# EAGLE design Mobo-v09 (EAGLE 9.7.0)

## Sheet 1 of 5
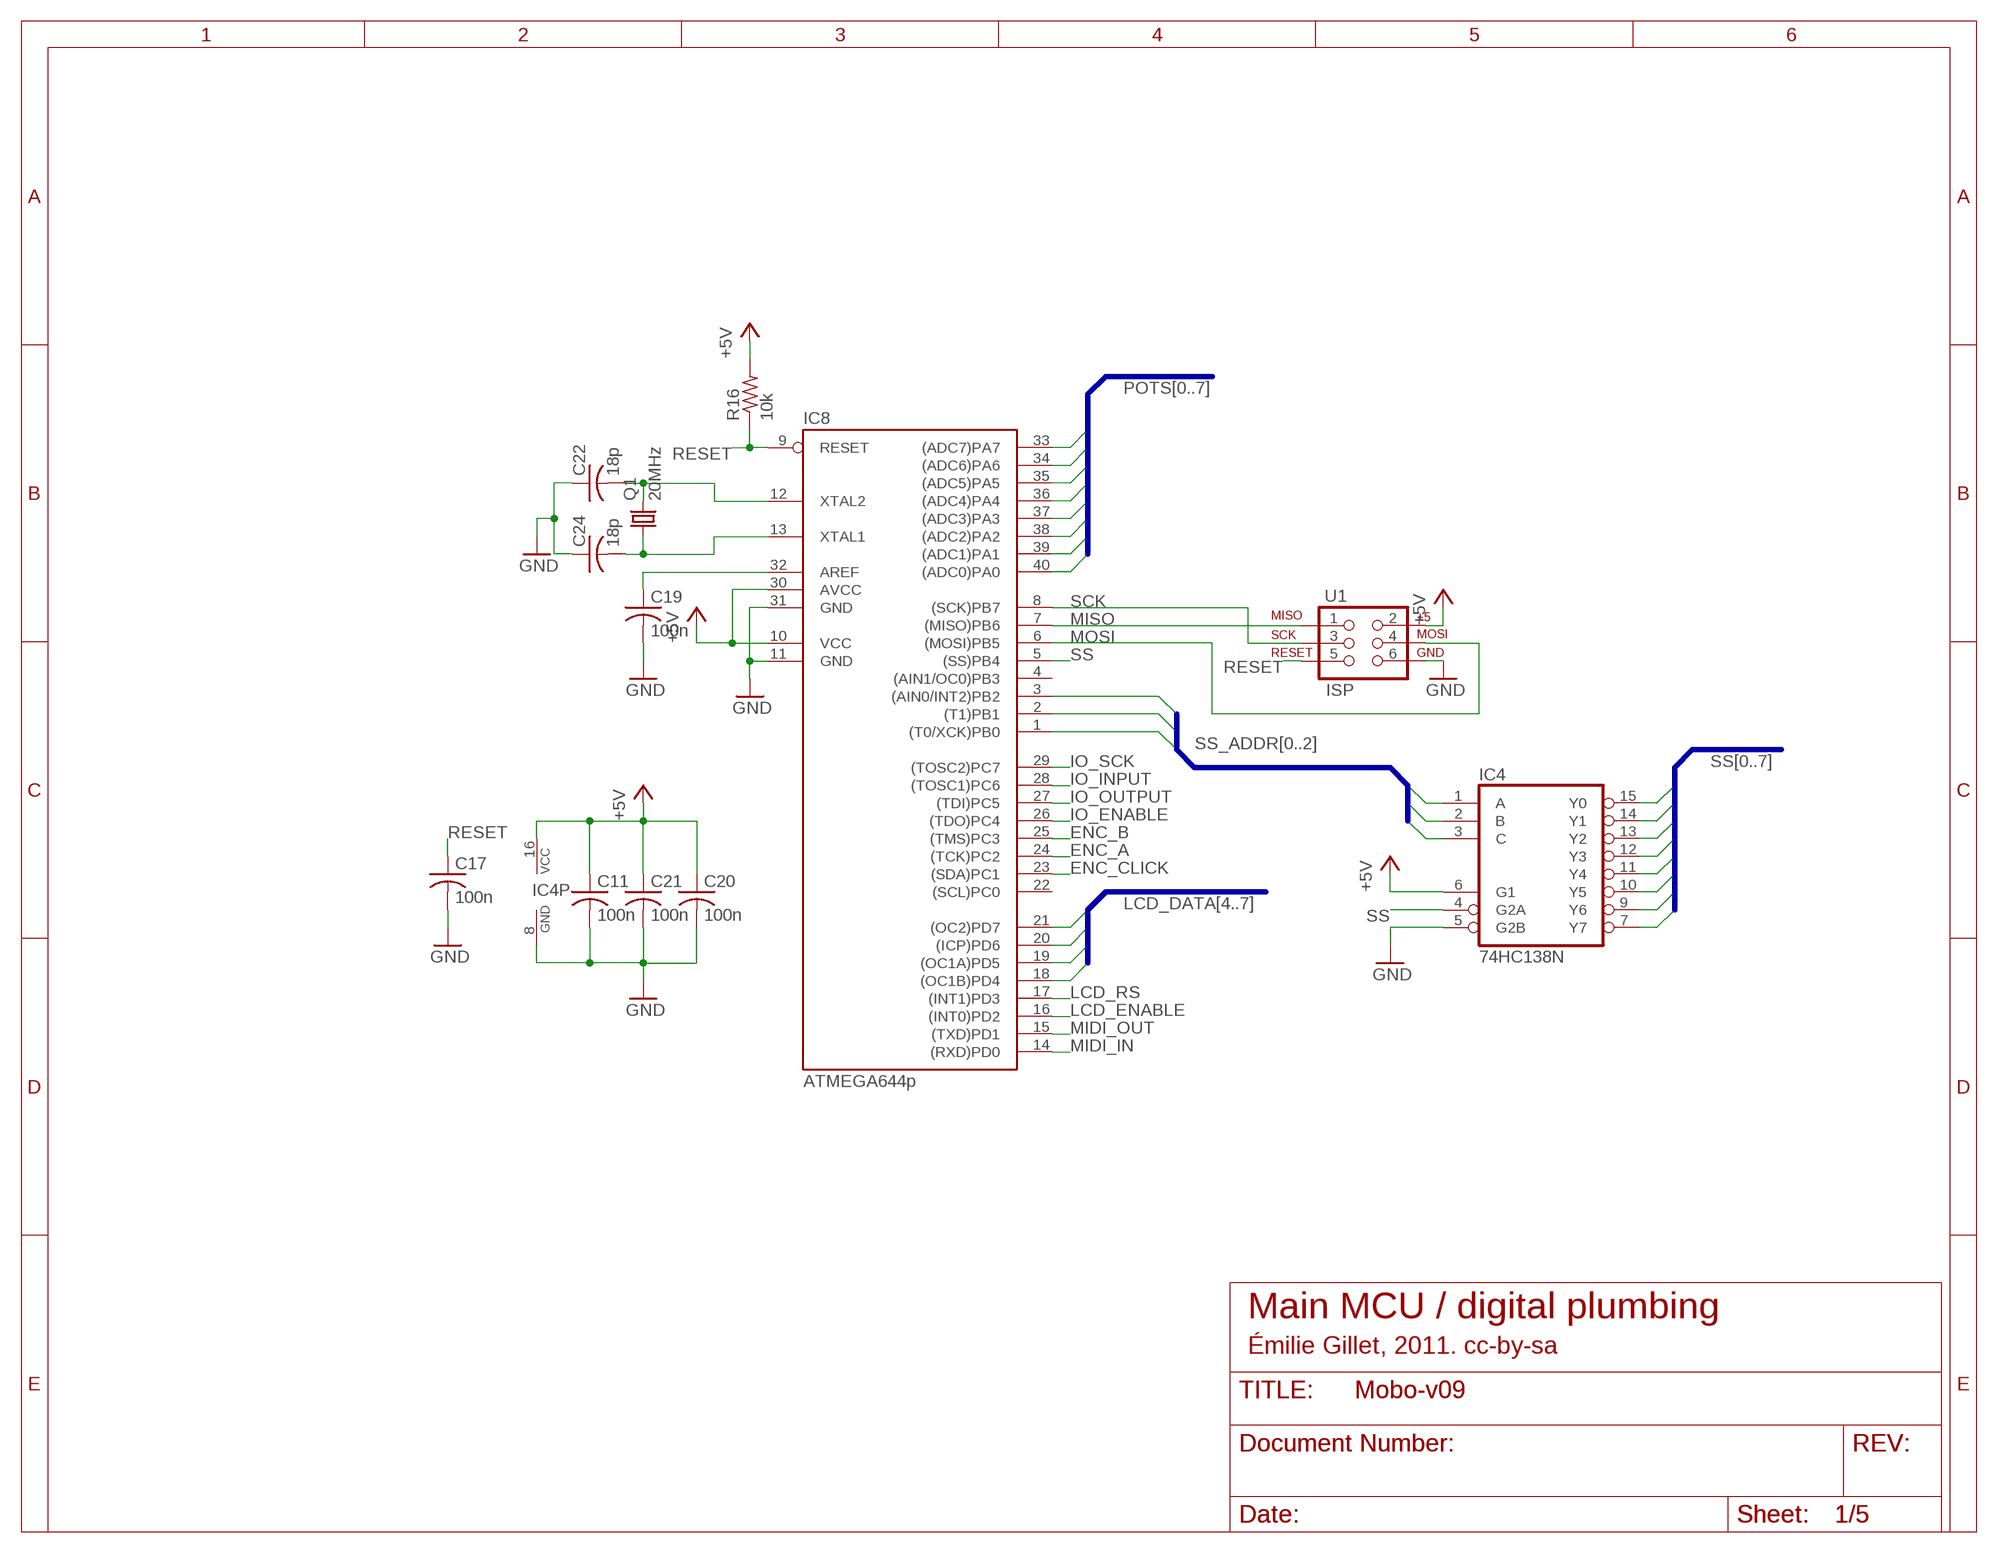
[diagram p0: schematic, sheet 1]

### Parts
C11  100n  C-US025-024X044  [C025-024X044]
C17  100n  C-US025-024X044  [C025-024X044]
C19  100n  C-US025-024X044  [C025-024X044]
C20  100n  C-US025-024X044  [C025-024X044]
C21  100n  C-US025-024X044  [C025-024X044]
C22  18p  C-US025-024X044  [C025-024X044]
C24  18p  C-US025-024X044  [C025-024X044]
IC4  74HC138N  [DIL16]
IC8  ATMEGA644p  MEGA16-P  [DIL40]
Q1  20MHz  CRYSTALHC49U-V  [HC49U-V]
R16  10k  R-US_0204/7  [0204/7]
U1  ISP  AVR_SPI_PRG_6PTH  [2X3]

### Nets
+5V: C11.1 C20.1 C21.1 IC4.6(G1) IC4.16(VCC) IC8.10(VCC) IC8.30(AVCC) R16.2 U1.2 ; also sheet 2,3,4,5
ENC_A: IC8.24((TCK)PC2) ; also sheet 2
ENC_B: IC8.25((TMS)PC3) ; also sheet 2
ENC_CLICK: IC8.23((SDA)PC1) ; also sheet 2
GND: C11.2 C17.2 C19.2 C20.2 C21.2 C22.1 C24.1 IC4.5(G2B) IC4.8(GND) IC8.11(GND) IC8.31(GND) U1.6 ; also sheet 2,3,4,5
IO_ENABLE: IC8.26((TDO)PC4) ; also sheet 2
IO_INPUT: IC8.28((TOSC1)PC6) ; also sheet 2
IO_OUTPUT: IC8.27((TDI)PC5) ; also sheet 2
IO_SCK: IC8.29((TOSC2)PC7) ; also sheet 2
LCD_DATA4: IC8.18((OC1B)PD4) ; also sheet 2
LCD_DATA5: IC8.19((OC1A)PD5) ; also sheet 2
LCD_DATA6: IC8.20((ICP)PD6) ; also sheet 2
LCD_DATA7: IC8.21((OC2)PD7) ; also sheet 2
LCD_ENABLE: IC8.16((INT0)PD2) ; also sheet 2
LCD_RS: IC8.17((INT1)PD3) ; also sheet 2
MIDI_IN: IC8.14((RXD)PD0) ; also sheet 3
MIDI_OUT: IC8.15((TXD)PD1) ; also sheet 3
MISO: IC8.7((MISO)PB6) U1.1 ; also sheet 3,4
MOSI: IC8.6((MOSI)PB5) U1.4 ; also sheet 3,4
N$7: C19.1 IC8.32(AREF)
N$82: C24.2 IC8.13(XTAL1) Q1.1
N$83: C22.2 IC8.12(XTAL2) Q1.2
POTS0: IC8.40((ADC0)PA0) ; also sheet 2
POTS1: IC8.39((ADC1)PA1) ; also sheet 2
POTS2: IC8.38((ADC2)PA2) ; also sheet 2
POTS3: IC8.37((ADC3)PA3) ; also sheet 2
POTS4: IC8.36((ADC4)PA4) ; also sheet 2
POTS5: IC8.35((ADC5)PA5) ; also sheet 2
POTS6: IC8.34((ADC6)PA6) ; also sheet 2
POTS7: IC8.33((ADC7)PA7) ; also sheet 2
RESET: C17.1 IC8.9(RESET) R16.1 U1.5
SCK: IC8.8((SCK)PB7) U1.3 ; also sheet 3,4
SS: IC4.4(G2A) IC8.5((SS)PB4)
SS0: IC4.15(Y0) ; also sheet 4
SS1: IC4.14(Y1) ; also sheet 4
SS2: IC4.13(Y2) ; also sheet 4
SS3: IC4.12(Y3) ; also sheet 4
SS4: IC4.11(Y4) ; also sheet 4
SS5: IC4.10(Y5) ; also sheet 4
SS6: IC4.9(Y6) ; also sheet 3
SS7: IC4.7(Y7) ; also sheet 3
SS_ADDR0: IC4.1(A) IC8.1((T0/XCK)PB0)
SS_ADDR1: IC4.2(B) IC8.2((T1)PB1)
SS_ADDR2: IC4.3(C) IC8.3((AIN0/INT2)PB2)
Unconnected: IC8.4((AIN1/OC0)PB3) IC8.22((SCL)PC0)

### Buses
POTS[0..7]
LCD_DATA[4..7]
SS_ADDR[0..2]
SS[0..7]

### Notes on the sheet
- Main MCU / digital plumbing
- Émilie Gillet, 2011. cc-by-sa

## Sheet 2 of 5
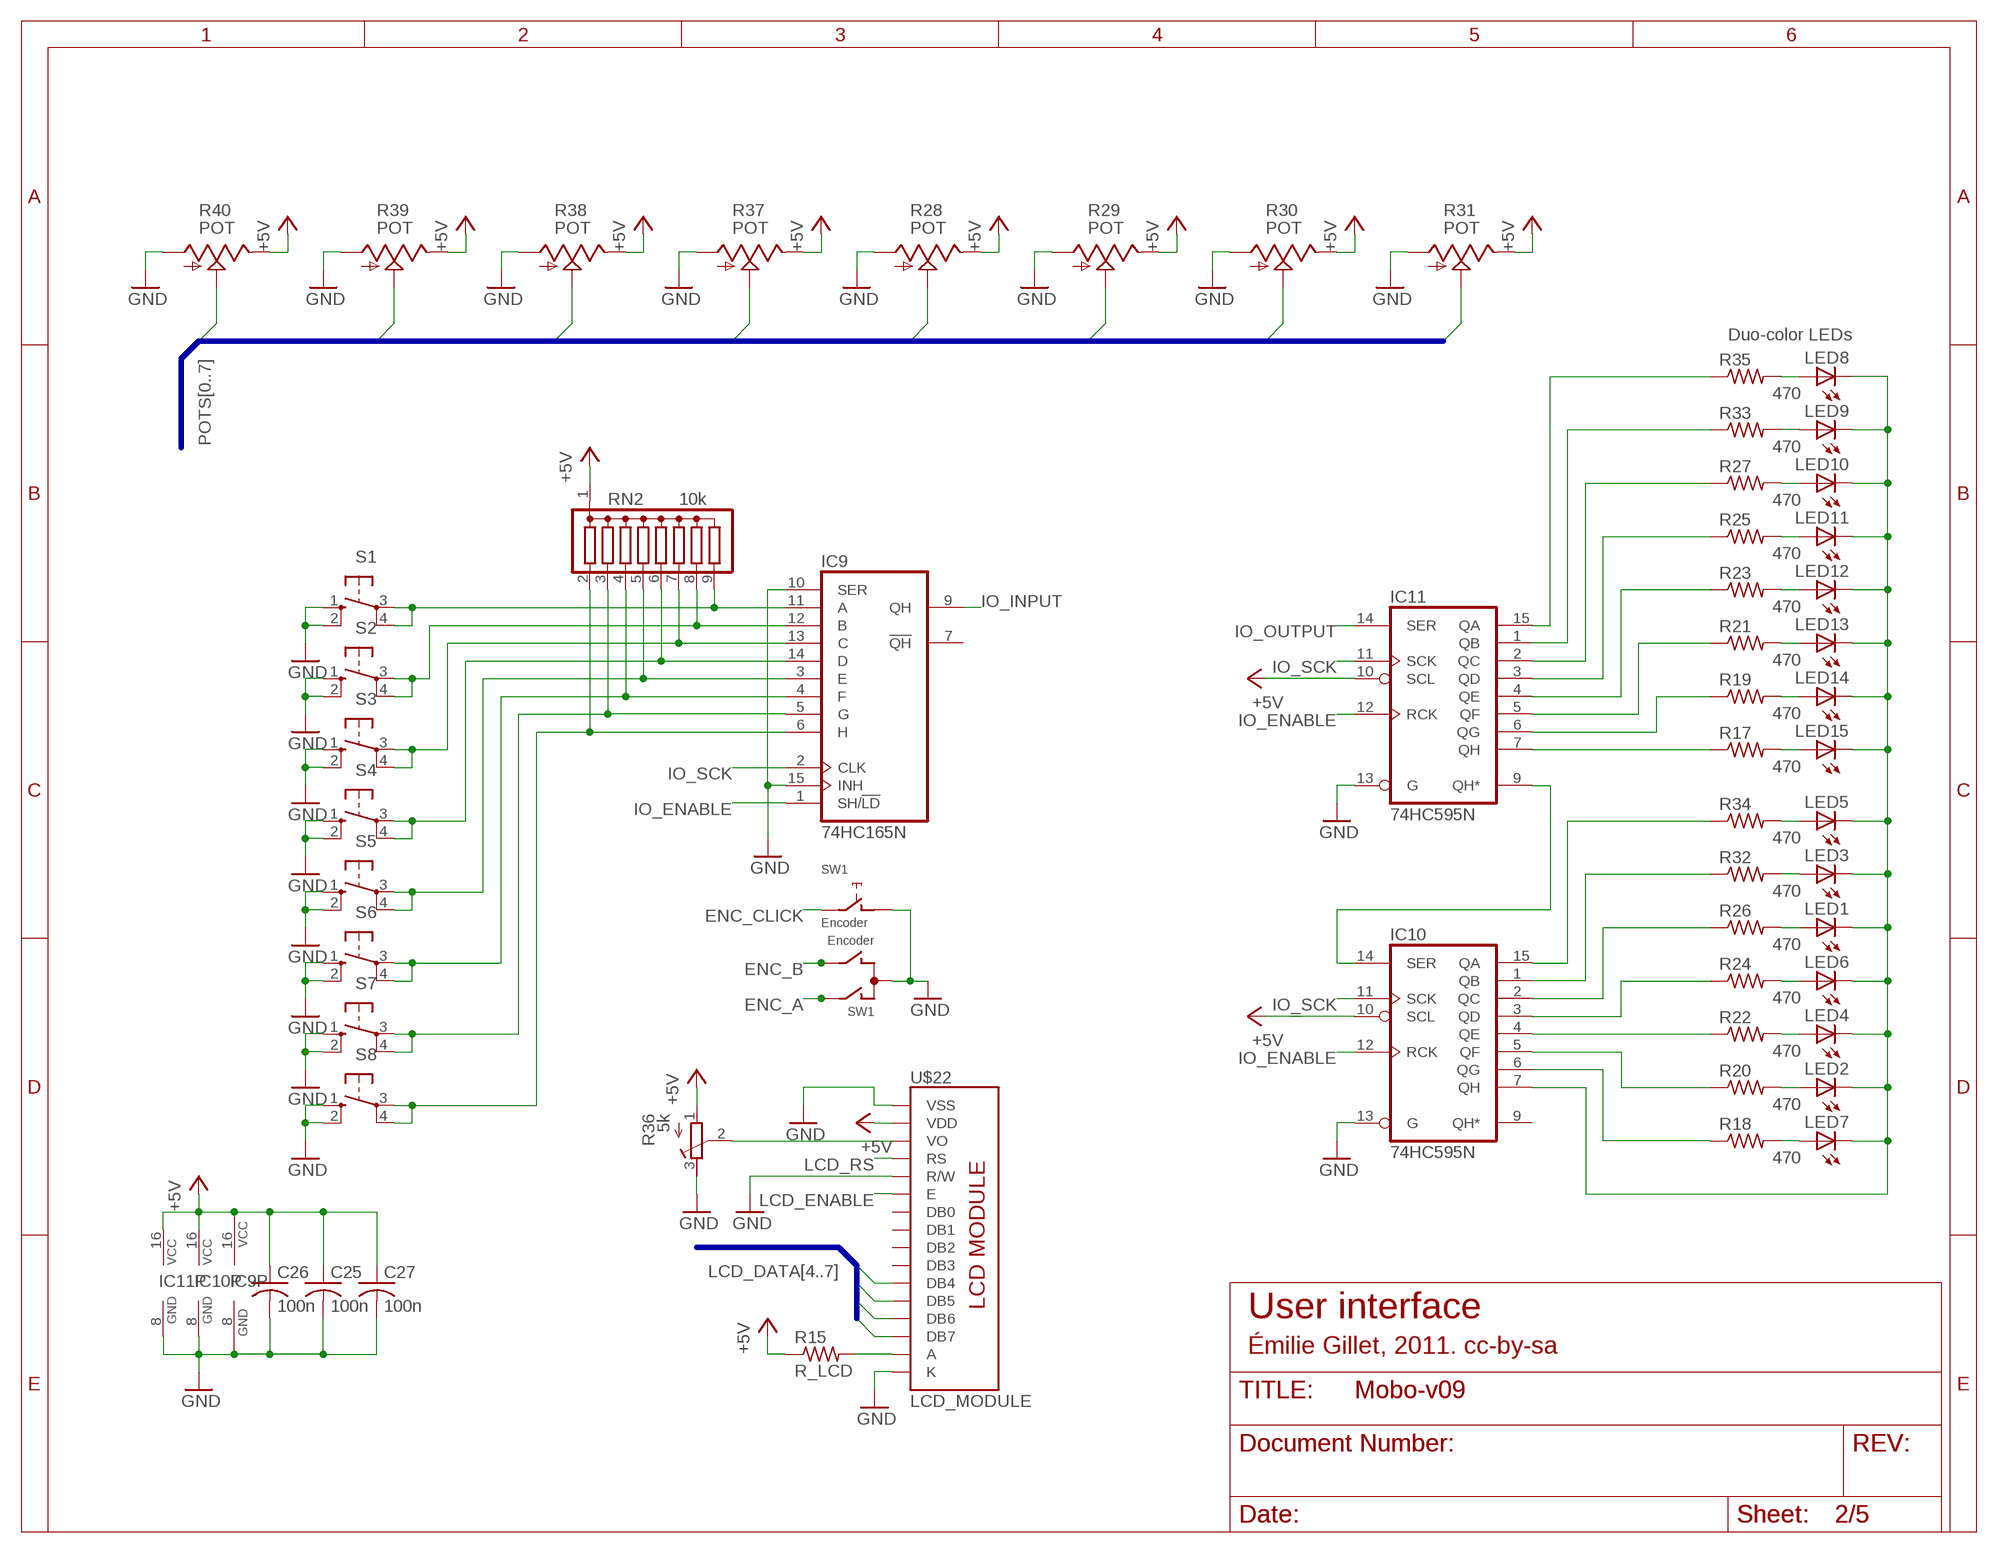
[diagram p1: schematic, sheet 2]

### Parts
C25  100n  C-US025-024X044  [C025-024X044]
C26  100n  C-US025-024X044  [C025-024X044]
C27  100n  C-US025-024X044  [C025-024X044]
IC9  74HC165N  74LS165N  [DIL16]
IC10  74HC595N  [DIL16]
IC11  74HC595N  [DIL16]
LED1  LED3MM  [LED3MM]
LED2  LED3MM  [LED3MM]
LED3  LED3MM  [LED3MM]
LED4  LED3MM  [LED3MM]
LED5  LED3MM  [LED3MM]
LED6  LED3MM  [LED3MM]
LED7  LED3MM  [LED3MM]
LED8  LED3MM  [LED3MM]
LED9  LED3MM  [LED3MM]
LED10  LED3MM  [LED3MM]
LED11  LED3MM  [LED3MM]
LED12  LED3MM  [LED3MM]
LED13  LED3MM  [LED3MM]
LED14  LED3MM  [LED3MM]
LED15  LED3MM  [LED3MM]
R15  R_LCD  R-US_0204/7  [0204/7]
R17  470  R-US_0204/7  [0204/7]
R18  470  R-US_0204/7  [0204/7]
R19  470  R-US_0204/7  [0204/7]
R20  470  R-US_0204/7  [0204/7]
R21  470  R-US_0204/7  [0204/7]
R22  470  R-US_0204/7  [0204/7]
R23  470  R-US_0204/7  [0204/7]
R24  470  R-US_0204/7  [0204/7]
R25  470  R-US_0204/7  [0204/7]
R26  470  R-US_0204/7  [0204/7]
R27  470  R-US_0204/7  [0204/7]
R28  POT  POT_USVERTICAL  [ALPS_POT_VERTICAL]
R29  POT  POT_USVERTICAL  [ALPS_POT_VERTICAL]
R30  POT  POT_USVERTICAL  [ALPS_POT_VERTICAL]
R31  POT  POT_USVERTICAL  [ALPS_POT_VERTICAL]
R32  470  R-US_0204/7  [0204/7]
R33  470  R-US_0204/7  [0204/7]
R34  470  R-US_0204/7  [0204/7]
R35  470  R-US_0204/7  [0204/7]
R36  5k  R-TRIMM3339P  [RTRIM3339P]
R37  POT  POT_USVERTICAL  [ALPS_POT_VERTICAL]
R38  POT  POT_USVERTICAL  [ALPS_POT_VERTICAL]
R39  POT  POT_USVERTICAL  [ALPS_POT_VERTICAL]
R40  POT  POT_USVERTICAL  [ALPS_POT_VERTICAL]
RN2  10k  G08R  [SIL9]
S1  40-XX  [B3F-40XX]
S2  40-XX  [B3F-40XX]
S3  40-XX  [B3F-40XX]
S4  40-XX  [B3F-40XX]
S5  40-XX  [B3F-40XX]
S6  40-XX  [B3F-40XX]
S7  40-XX  [B3F-40XX]
S8  40-XX  [B3F-40XX]
SW1  Encoder  EC12E_SW  [ALPS_EC12E_SW]
U$22  LCD_MODULE  [LCD_MODULE_2X40]

### Nets
+5V: C25.1 C26.1 C27.1 IC9.16(VCC) IC10.10(SCL) IC10.16(VCC) IC11.10(SCL) IC11.16(VCC) R15.1 R28.P$1(E) R29.P$1(E) R30.P$1(E) R31.P$1(E) R36.1(E) R37.P$1(E) R38.P$1(E) R39.P$1(E) R40.P$1(E) RN2.1 U$22.2(VDD) ; also sheet 1,3,4,5
ENC_A: SW1.A ; also sheet 1
ENC_B: SW1.B ; also sheet 1
ENC_CLICK: SW1.E ; also sheet 1
GND: C25.2 C26.2 C27.2 IC9.8(GND) IC9.10(SER) IC9.15(INH) IC10.8(GND) IC10.13(G) IC11.8(GND) IC11.13(G) R28.P$3(A) R29.P$3(A) R30.P$3(A) R31.P$3(A) R36.3(A) R37.P$3(A) R38.P$3(A) R39.P$3(A) R40.P$3(A) S1.1(S) S1.2(S1) S2.1(S) S2.2(S1) S3.1(S) S3.2(S1) S4.1(S) S4.2(S1) S5.1(S) S5.2(S1) S6.1(S) S6.2(S1) S7.1(S) S7.2(S1) S8.1(S) S8.2(S1) SW1.C SW1.D U$22.1(VSS) U$22.5(R/W) U$22.16(K) ; also sheet 1,3,4,5
IO_ENABLE: IC9.1(SH/!LD) IC10.12(RCK) IC11.12(RCK) ; also sheet 1
IO_INPUT: IC9.9(QH) ; also sheet 1
IO_OUTPUT: IC11.14(SER) ; also sheet 1
IO_SCK: IC9.2(CLK) IC10.11(SCK) IC11.11(SCK) ; also sheet 1
LCD_DATA4: U$22.11(DB4) ; also sheet 1
LCD_DATA5: U$22.12(DB5) ; also sheet 1
LCD_DATA6: U$22.13(DB6) ; also sheet 1
LCD_DATA7: U$22.14(DB7) ; also sheet 1
LCD_ENABLE: U$22.6(E) ; also sheet 1
LCD_RS: U$22.4(RS) ; also sheet 1
N$1: IC11.2(QC) R27.1
N$2: IC9.3(E) RN2.5 S5.3(P) S5.4(P1)
N$3: IC9.5(G) RN2.3 S7.3(P) S7.4(P1)
N$10: IC9.4(F) RN2.4 S6.3(P) S6.4(P1)
N$12: IC9.14(D) RN2.6 S4.3(P) S4.4(P1)
N$18: R36.2(S) U$22.3(VO)
N$24: IC9.11(A) RN2.9 S1.3(P) S1.4(P1)
N$30: IC11.15(QA) R35.1
N$31: IC11.1(QB) R33.1
N$33: IC11.3(QD) R25.1
N$34: IC11.4(QE) R23.1
N$35: IC11.5(QF) R21.1
N$36: IC11.7(QH) R17.1
N$37: IC11.6(QG) R19.1
N$42: LED8.A R35.2
N$43: LED9.A R33.2
N$44: LED10.A R27.2
N$45: LED11.A R25.2
N$46: LED12.A R23.2
N$47: LED13.A R21.2
N$48: LED14.A R19.2
N$49: LED15.A R17.2
N$51: IC10.7(QH) LED1.K(C) LED2.K(C) LED3.K(C) LED4.K(C) LED5.K(C) LED6.K(C) LED7.K(C) LED8.K(C) LED9.K(C) LED10.K(C) LED11.K(C) LED12.K(C) LED13.K(C) LED14.K(C) LED15.K(C)
N$62: IC10.15(QA) R34.1
N$63: IC10.1(QB) R32.1
N$67: IC10.3(QD) R24.1
N$69: IC10.4(QE) R22.1
N$70: IC10.5(QF) R20.1
N$75: LED5.A R34.2
N$78: LED3.A R32.2
N$79: R15.2 U$22.15(A)
N$80: LED1.A R26.2
N$84: LED6.A R24.2
N$85: LED4.A R22.2
N$86: LED2.A R20.2
N$87: IC10.14(SER) IC11.9(QH*)
N$88: IC9.12(B) RN2.8 S2.3(P) S2.4(P1)
N$89: IC10.2(QC) R26.1
N$90: IC9.13(C) RN2.7 S3.3(P) S3.4(P1)
N$95: IC9.6(H) RN2.2 S8.3(P) S8.4(P1)
N$96: LED7.A R18.2
N$98: IC10.6(QG) R18.1
POTS0: R40.P$2(S) ; also sheet 1
POTS1: R39.P$2(S) ; also sheet 1
POTS2: R38.P$2(S) ; also sheet 1
POTS3: R37.P$2(S) ; also sheet 1
POTS4: R28.P$2(S) ; also sheet 1
POTS5: R29.P$2(S) ; also sheet 1
POTS6: R30.P$2(S) ; also sheet 1
POTS7: R31.P$2(S) ; also sheet 1
Unconnected: IC9.7(!QH) IC10.9(QH*) SW1.GND1(G) SW1.GND2(G) U$22.7(DB0) U$22.8(DB1) U$22.9(DB2) U$22.10(DB3)

### Buses
POTS[0..7]
LCD_DATA[4..7]

### Notes on the sheet
- Duo-color LEDs
- User interface
- Émilie Gillet, 2011. cc-by-sa

## Sheet 3 of 5
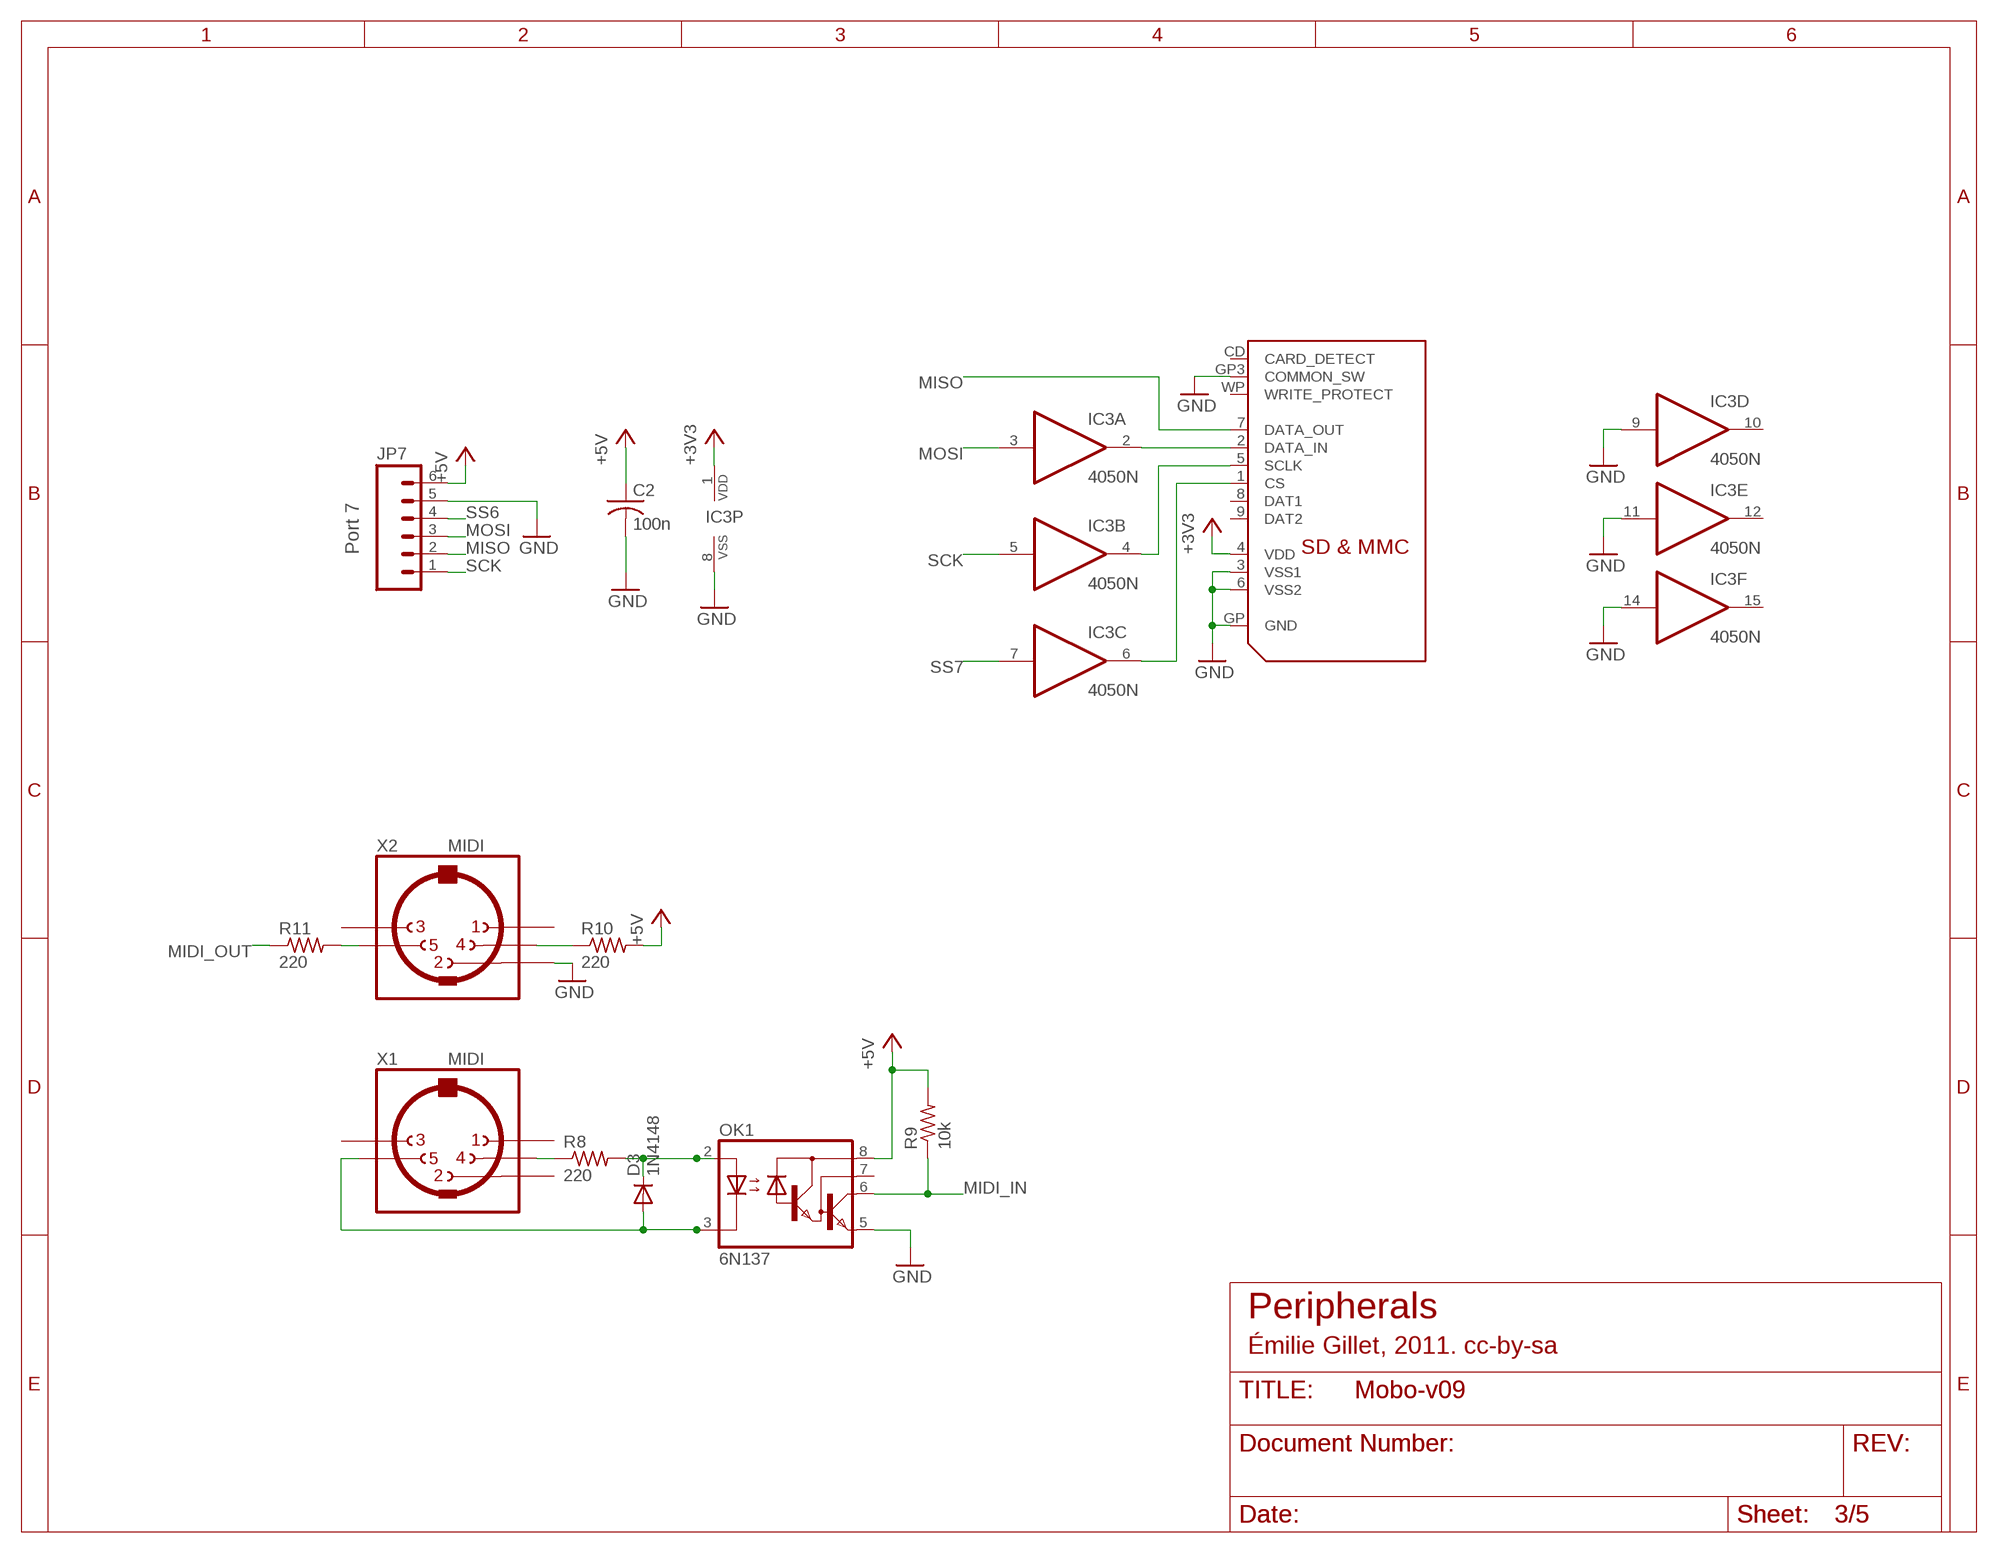
[diagram p2: schematic, sheet 3]

### Parts
C2  100n  C-US025-024X044  [C025-024X044]
D3  1N4148  DIODE-D-5  [D-5]
IC3  4050N  [DIL16]
JP7  M06SIP  [1X06]
OK1  6N137  6N138  [DIL08]
R8  220  R-US_0204/7  [0204/7]
R9  10k  R-US_0204/7  [0204/7]
R10  220  R-US_0204/7  [0204/7]
R11  220  R-US_0204/7  [0204/7]
U$26  SDMMC06132  [06132]
X1  MIDI  MAB5SH  [MAB5SH]
X2  MIDI  MAB5SH  [MAB5SH]

### Nets
+3V3: IC3.1(P:VDD) U$26.4(VDD) ; also sheet 5
+5V: C2.1 JP7.6 OK1.8(VCC) R9.2 R10.2 ; also sheet 1,2,4,5
GND: C2.2 IC3.8(P:VSS) IC3.9(D:I) IC3.11(E:I) IC3.14(F:I) JP7.5 OK1.5(GND) U$26.3(VSS1) U$26.6(VSS2) U$26.GP3(COMMON_SW) U$26.GP(GND) X2.2 ; also sheet 1,2,4,5
MIDI_IN: OK1.6(VO) R9.1 ; also sheet 1
MIDI_OUT: R11.1 ; also sheet 1
MISO: JP7.2 U$26.7(DATA_OUT) ; also sheet 1,4
MOSI: IC3.3(A:I) JP7.3 ; also sheet 1,4
MOSI_3V3: IC3.2(A:O) U$26.2(DATA_IN)
N$5: R11.2 X2.5
N$28: D3.C OK1.2(A) R8.2
N$68: R10.1 X2.4
N$72: R8.1 X1.4
N$73: D3.A OK1.3(C) X1.5
SCK: IC3.5(B:I) JP7.1 ; also sheet 1,4
SCK_3V3: IC3.4(B:O) U$26.5(SCLK)
SS6: JP7.4 ; also sheet 1
SS7: IC3.7(C:I) ; also sheet 1
SS7_3V3: IC3.6(C:O) U$26.1(CS)
Unconnected: IC3.10(D:O) IC3.12(E:O) IC3.15(F:O) OK1.7(VB) U$26.8(DAT1) U$26.9(DAT2) U$26.CD(CARD_DETECT) U$26.WP(WRITE_PROTECT) X1.1 X1.2 X1.3 X2.1 X2.3

### Notes on the sheet
- Port 7
- Peripherals
- Émilie Gillet, 2011. cc-by-sa

## Sheet 4 of 5
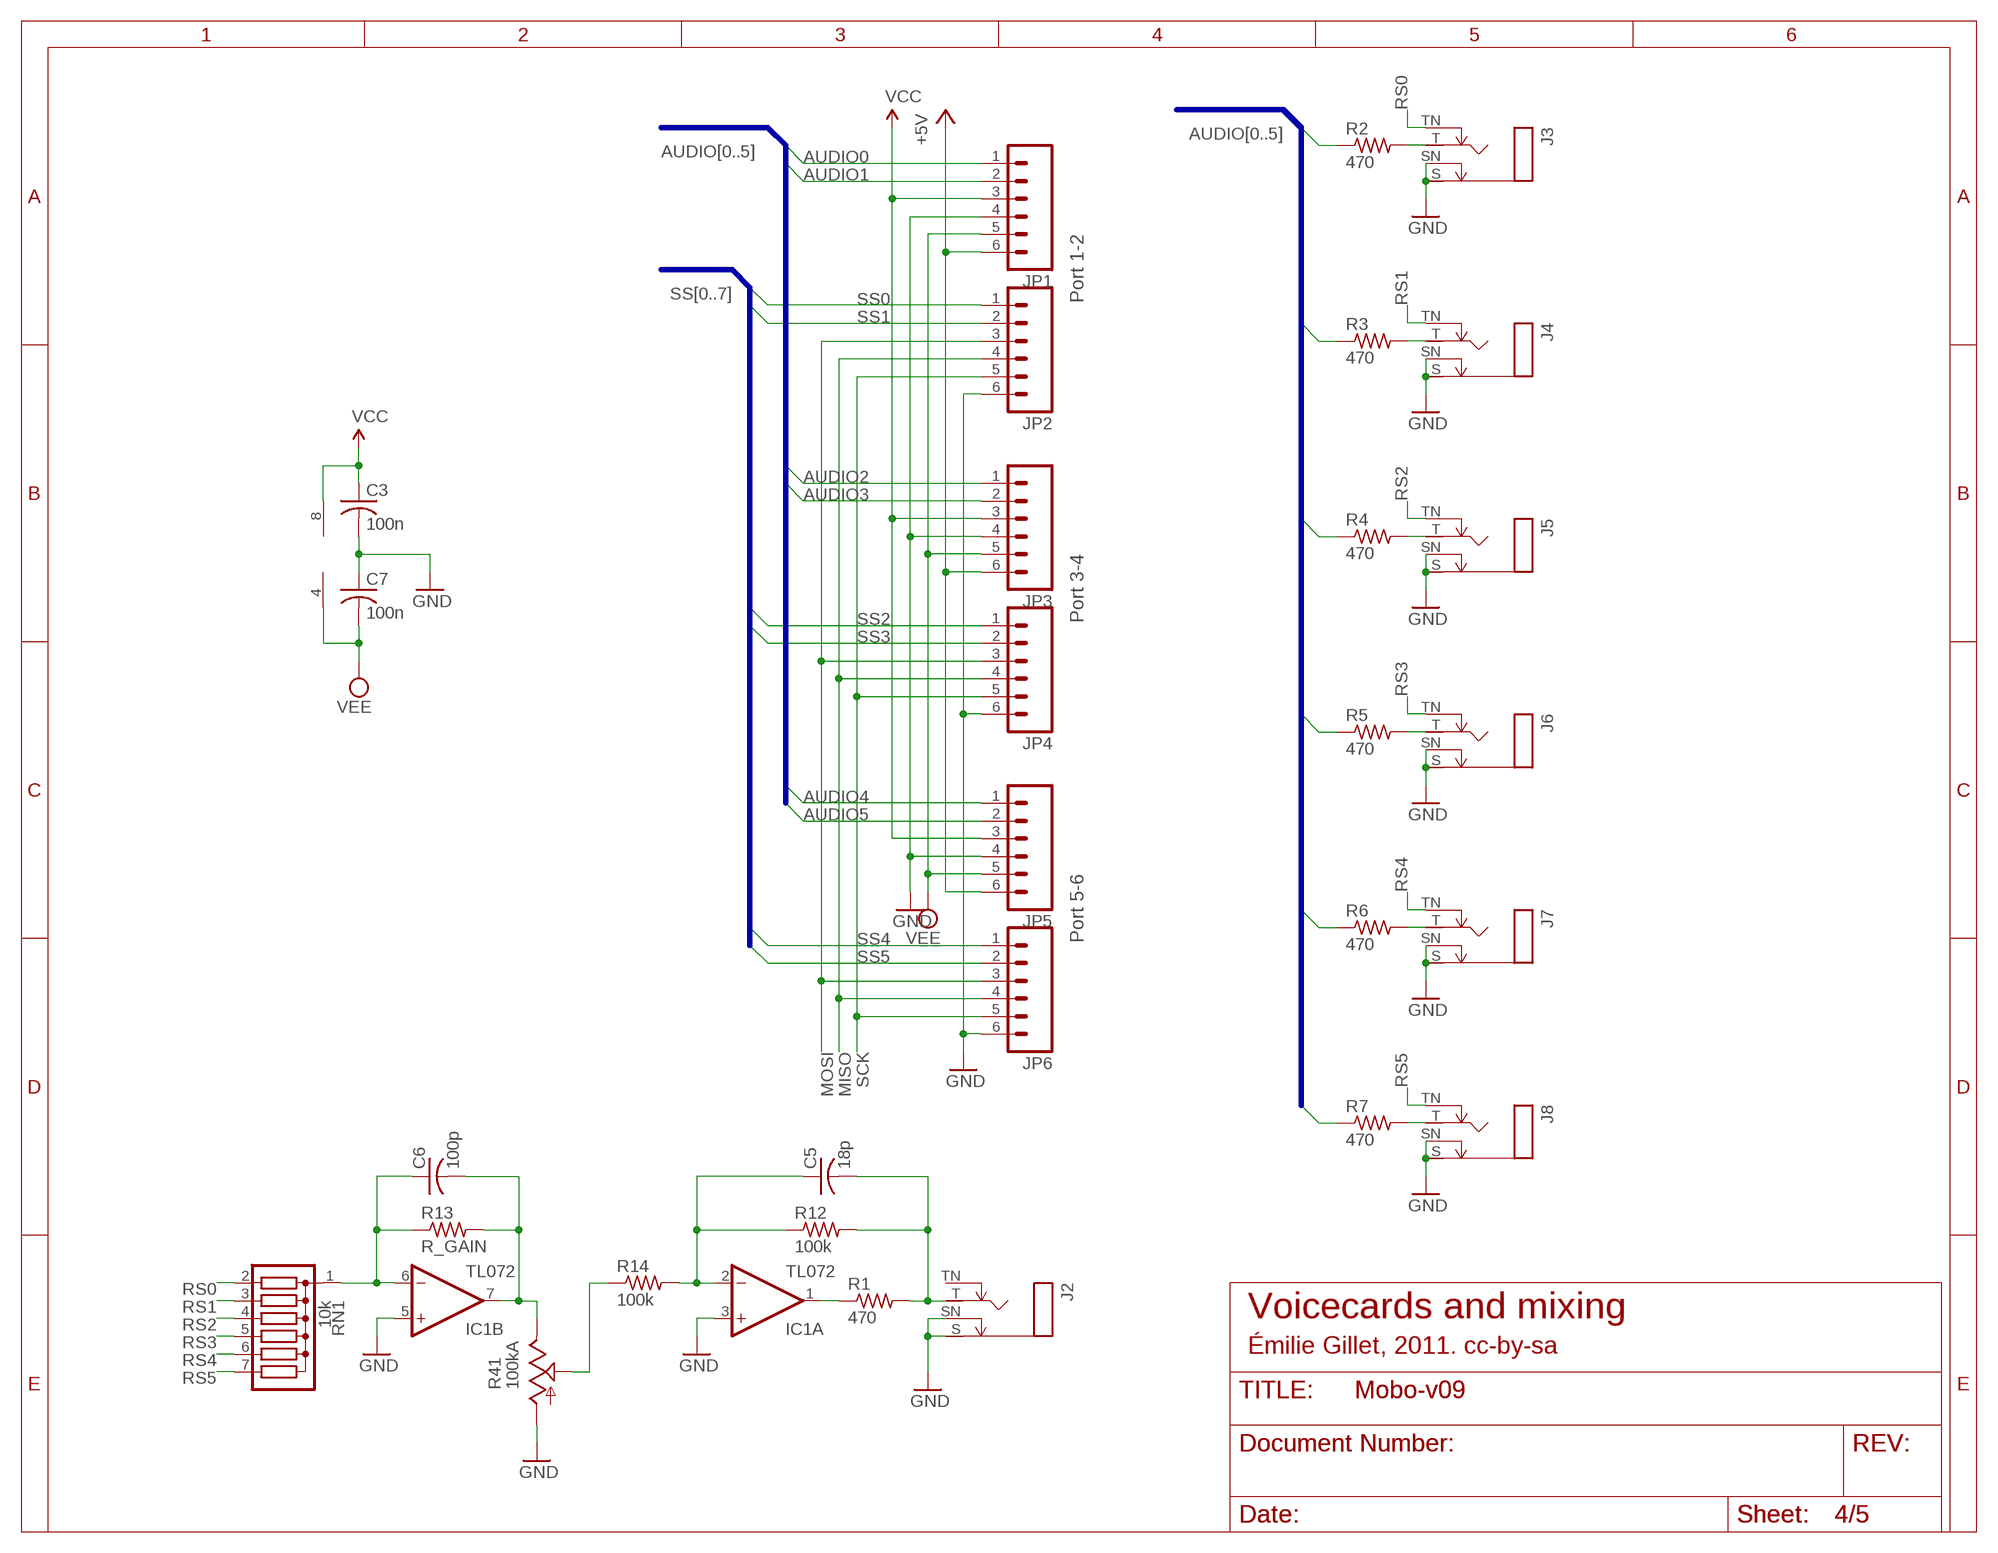
[diagram p3: schematic, sheet 4]

### Parts
C3  100n  C-US025-024X044  [C025-024X044]
C5  18p  C-US025-024X044  [C025-024X044]
C6  100p  C-US025-024X044  [C025-024X044]
C7  100n  C-US025-024X044  [C025-024X044]
IC1  TL072  TL072P  [DIL08]
J2  MONOSWSLIM  [NRJ4HF]
J3  MONOSWSLIM  [NRJ4HF]
J4  MONOSWSLIM  [NRJ4HF]
J5  MONOSWSLIM  [NRJ4HF]
J6  MONOSWSLIM  [NRJ4HF]
J7  MONOSWSLIM  [NRJ4HF]
J8  MONOSWSLIM  [NRJ4HF]
JP1  M06SIP  [1X06]
JP2  M06SIP  [1X06]
JP3  M06SIP  [1X06]
JP4  M06SIP  [1X06]
JP5  M06SIP  [1X06]
JP6  M06SIP  [1X06]
R1  470  R-US_0204/7  [0204/7]
R2  470  R-US_0204/7  [0204/7]
R3  470  R-US_0204/7  [0204/7]
R4  470  R-US_0204/7  [0204/7]
R5  470  R-US_0204/7  [0204/7]
R6  470  R-US_0204/7  [0204/7]
R7  470  R-US_0204/7  [0204/7]
R12  100k  R-US_0204/7  [0204/7]
R13  R_GAIN  R-US_0204/7  [0204/7]
R14  100k  R-US_0204/7  [0204/7]
R41  100kA  POT_USVERTICAL  [ALPS_POT_VERTICAL]
RN1  10k  G06R  [SIL7]

### Nets
+5V: JP1.6 JP3.6 JP5.6 ; also sheet 1,2,3,5
AUDIO0: JP1.1 R2.1
AUDIO1: JP1.2 R3.1
AUDIO2: JP3.1 R4.1
AUDIO3: JP3.2 R5.1
AUDIO4: JP5.1 R6.1
AUDIO5: JP5.2 R7.1
GND: C3.2 C7.1 IC1.3(A:+IN) IC1.5(B:+IN) J2.S J2.SN J3.S J3.SN J4.S J4.SN J5.S J5.SN J6.S J6.SN J7.S J7.SN J8.S J8.SN JP1.4 JP2.6 JP3.4 JP4.6 JP5.4 JP6.6 R41.P$3(A) ; also sheet 1,2,3,5
MISO: JP2.4 JP4.4 JP6.4 ; also sheet 1,3
MOSI: JP2.3 JP4.3 JP6.3 ; also sheet 1,3
N$6: C6.2 IC1.7(B:OUT) R13.2 R41.P$1(E)
N$9: C6.1 IC1.6(B:-IN) R13.1 RN1.1
N$13: R14.1 R41.P$2(S)
N$15: C5.1 IC1.2(A:-IN) R12.1 R14.2
N$16: C5.2 J2.T R1.2 R12.2
N$19: J3.T R2.2
N$32: J4.T R3.2
N$40: J5.T R4.2
N$57: J6.T R5.2
N$64: J7.T R6.2
N$76: J8.T R7.2
N$81: IC1.1(A:OUT) R1.1
RS0: J3.TN RN1.2
RS1: J4.TN RN1.3
RS2: J5.TN RN1.4
RS3: J6.TN RN1.5
RS4: J7.TN RN1.6
RS5: J8.TN RN1.7
SCK: JP2.5 JP4.5 JP6.5 ; also sheet 1,3
SS0: JP2.1 ; also sheet 1
SS1: JP2.2 ; also sheet 1
SS2: JP4.1 ; also sheet 1
SS3: JP4.2 ; also sheet 1
SS4: JP6.1 ; also sheet 1
SS5: JP6.2 ; also sheet 1
VCC: C3.1 IC1.8(P:V+) JP1.3 JP3.3 JP5.3 ; also sheet 5
VEE: C7.2 IC1.4(P:V-) JP1.5 JP3.5 JP5.5 ; also sheet 5
Unconnected: J2.TN

### Buses
SS[0..7]
AUDIO[0..5]

### Notes on the sheet
- Port 1-2
- Port 3-4
- Port 5-6
- Voicecards and mixing
- Émilie Gillet, 2011. cc-by-sa

## Sheet 5 of 5
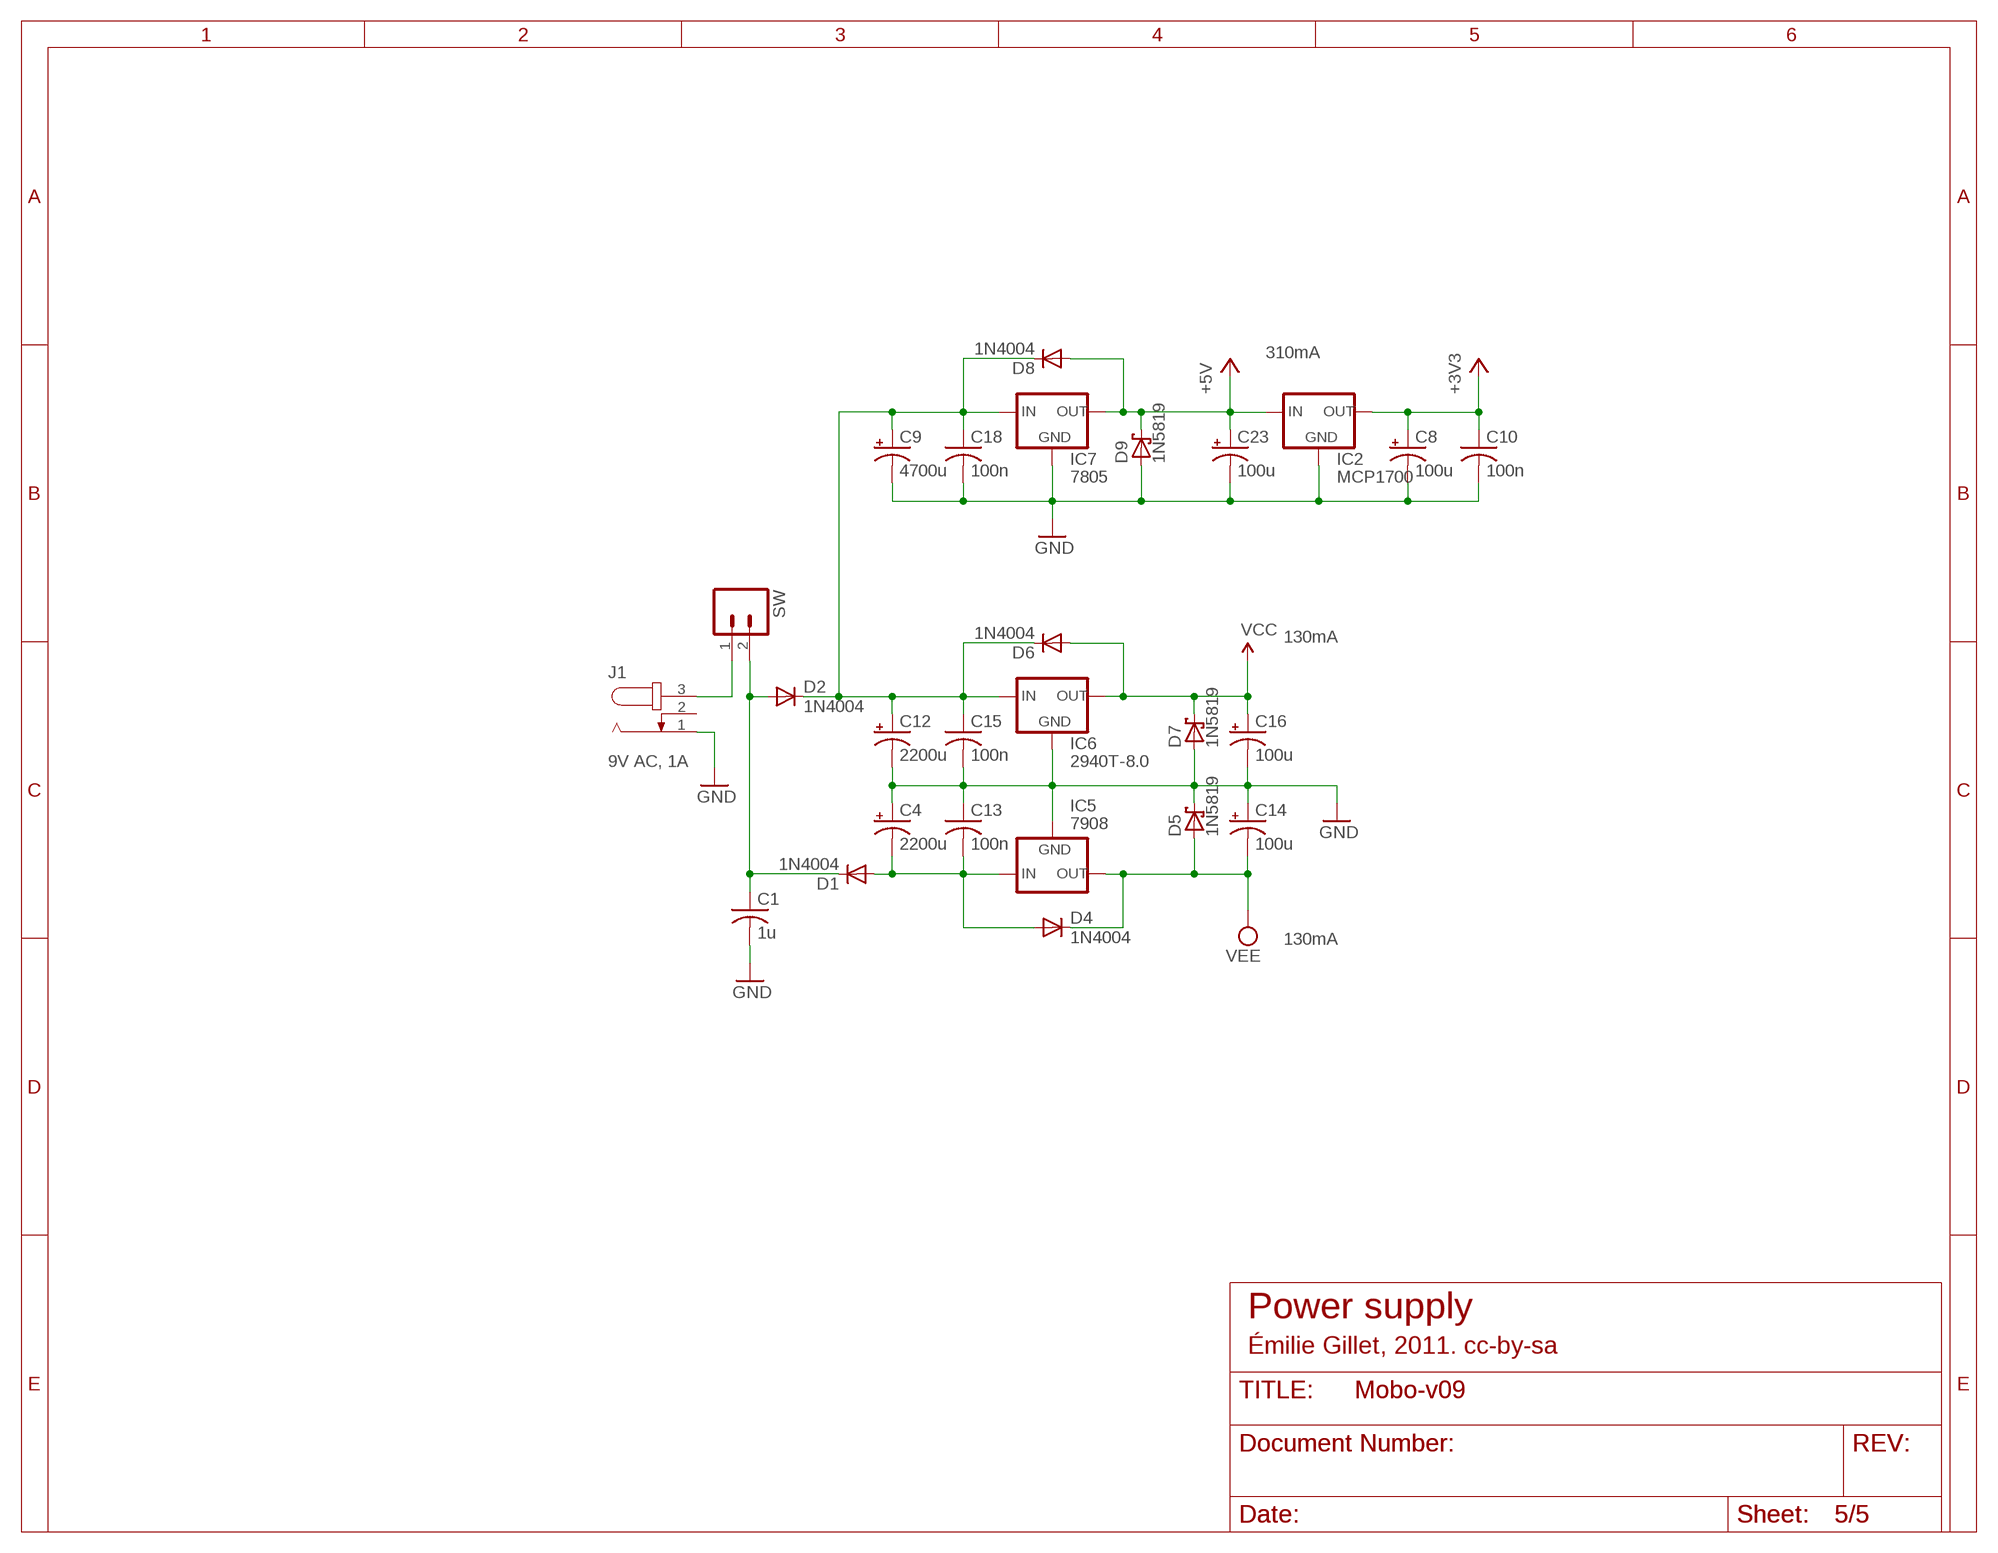
[diagram p4: schematic, sheet 5]

### Parts
C1  1u  C-US075-052X106  [C075-052X106]
C4  2200u  CPOL-USE5-13  [E5-13]
C8  100u  CPOL-USE2.5-7  [E2,5-7]
C9  4700u  CPOL-USE7.5-16  [E7,5-16]
C10  100n  C-US025-024X044  [C025-024X044]
C12  2200u  CPOL-USE5-13  [E5-13]
C13  100n  C-US025-025X050  [C025-025X050]
C14  100u  CPOL-USE2.5-7  [E2,5-7]
C15  100n  C-US025-025X050  [C025-025X050]
C16  100u  CPOL-USE2.5-7  [E2,5-7]
C18  100n  C-US025-025X050  [C025-025X050]
C23  100u  CPOL-USE2.5-7  [E2,5-7]
D1  1N4004  [DO41-10]
D2  1N4004  [DO41-10]
D4  1N4004  [DO41-10]
D5  1N5819  1N5819-T  [DO41-7.6]
D6  1N4004  [DO41-10]
D7  1N5819  1N5819-T  [DO41-7.6]
D8  1N4004  [DO41-10]
D9  1N5819  1N5819-T  [DO41-7.6]
IC2  MCP1700  MCP1700INLINE  [TO92-INLINE]
IC5  7908  79XXS  [79XXS]
IC6  2940T-8.0  78XXL  [78XXL]
IC7  7805  78XXS  [78XXS]
J1  JACK-PLUG2  [SPC4078_BIG_HOLES]
SW  M02PTH  [1X02]

### Nets
+3V3: C8.+ C10.1 IC2.3(OUT) ; also sheet 3
+5V: C23.+ D8.A D9.C IC2.2(IN) IC7.OUT ; also sheet 1,2,3,4
GND: C1.2 C4.+ C8.- C9.- C10.2 C12.- C13.1 C14.+ C15.2 C16.- C18.2 C23.- D5.C D7.A D9.A IC2.1(GND) IC5.GND IC6.GND IC7.GND J1.1 ; also sheet 1,2,3,4
N$4: J1.3 SW.1
N$20: C4.- C13.2 D1.A D4.A IC5.IN
N$25: C9.+ C12.+ C15.1 C18.1 D2.C D6.C D8.C IC6.IN IC7.IN
N$29: C1.1 D1.C D2.A SW.2
VCC: C16.+ D6.A D7.C IC6.OUT ; also sheet 4
VEE: C14.- D4.C D5.A IC5.OUT ; also sheet 4
Unconnected: J1.2

### Notes on the sheet
- 310mA
- 130mA
- 9V AC, 1A
- 130mA
- Power supply
- Émilie Gillet, 2011. cc-by-sa

## Library data of the parts
C1-C3 C5-C7 C10 C11 C13 C15 C17-C22 C24-C27 = rcl:C-US: CAPACITOR, American symbol
C4 C8 C9 C12 C14 C16 C23 = rcl:CPOL-US: POLARIZED CAPACITOR, American symbol
D1 D2 D4 D6 D8 = diode:1N4004: DIODE general purpose rectifier, 1 A
D3 = diode:DIODE-: DIODE
D5 D7 D9 = diode:1N581*: 1.0A SCHOTTKY BARRIER RECTIFIER Source: http://www.diodes.com/datasheets/ds23001.pdf
IC1 = og-linear:TL072: OP AMP
IC2 = adafruit:MCP1700: VOLTAGE REGULATOR
IC3 = 40xx:4050: Hex non-inverting BUFFER
IC4 = 74xx-eu:74*138: 3-line to 8-line DECODER/DEMULTIPLEXER
IC5 = v-reg:79XXS: VOLTAGE REGULATOR
IC6 = v-reg:78XXL: VOLTAGE REGULATOR
IC7 = v-reg:78XXS: VOLTAGE REGULATOR
IC8 = atmel:MEGA16-P: MICROCONTROLLER 16 Kbytes FLASH 1 kbytes SRAM 512 bytes EEPROM USART 8-channel 10 bit ADC Source: avr.lbr
IC9 = 74xx-us:74*165: 8-bit parallel load SHIFT REGISTER
IC10 IC11 = 74xx-eu:74*595: 8-bit SHIFT REGISTER, output latch
J1 = con-jack2:JACK-PLUG: DC POWER JACK Power Jack, DC, Right Angle, Through Hole, Rated 5A at 16VDC, PC Terminals Distributor: Farnell (www.Farnell.de) Drawing: 84N1161.pdf / 84N1162.pdf Manufacturer: SPC Technology (www.spctechnology.com) Type: SPC4077 / SPC 4078
J2-J8 = og-neutrik:MONOSW
JP1-JP7 = SparkFun:M06: Header 6 Standard 6-pin 0.1" header. Use with straight break away headers (SKU : PRT-00116), right angle break away headers (PRT-00553), swiss pins (PRT-00743), machine pins (PRT-00117), and female headers (PRT-00115). Molex polarized connector foot print use with SKU : PRT-08094 with associated crimp pins and housings. NOTES ON THE VARIANTS LOCK and LOCK_LONGPADS... This footprint was designed to help hold the alignment of a through-hole component (i.e. 6-pin header) while soldering it into place. You may notice that each hole has been shifted either up or down by 0.005 of an inch from it's more standard position (which is a perfectly straight line). This slight alteration caused the pins (the squares in the middle) to touch the edges of the holes. Because they are alternating, it causes a "brace" to hold the component in place. 0.005 has proven to be the perfect amount of "off-center" position when using our standard breakaway headers. Although looks a little odd when you look at the bare footprint, once you have a header in there, the alteration is very hard to notice. Also, if you push a header all the way into place, it is covered up entirely on the bottom side. This idea of altering the position of holes to aid alignment will be further integrated into the Sparkfun Library for other footprints. It can help hold any component with 3 or more connection pins.
LED1-LED15 = led:LED: LED OSRAM: - CHIPLED LG R971, LG N971, LY N971, LG Q971, LY Q971, LO R971, LY R971 LH N974, LH R974 LS Q976, LO Q976, LY Q976 LO Q996 - Hyper CHIPLED LW Q18S LB Q993, LB Q99A, LB R99A - SideLED LS A670, LO A670, LY A670, LG A670, LP A670 LB A673, LV A673, LT A673, LW A673 LH A674 LY A675 LS A676, LA A676, LO A676, LY A676, LW A676 LS A679, LY A679, LG A679 - Hyper Micro SIDELED® LS Y876, LA Y876, LO Y876, LY Y876 LT Y87S - SmartLED LW L88C, LW L88S LB L89C, LB L89S, LG L890 LS L89K, LO L89K, LY L89K LS L896, LA L896, LO L896, LY L896 - TOPLED LS T670, LO T670, LY T670, LG T670, LP T670 LSG T670, LSP T670, LSY T670, LOP T670, LYG T670 LG T671, LOG T671, LSG T671 LB T673, LV T673, LT T673, LW T673 LH T674 LS T676, LA T676, LO T676, LY T676, LB T676, LH T676, LSB T676, LW T676 LB T67C, LV T67C, LT T67C, LS T67K, LO T67K, LY T67K, LW E67C LS E67B, LA E67B, LO E67B, LY E67B, LB E67C, LV E67C, LT E67C LW T67C LS T679, LY T679, LG T679 LS T770, LO T770, LY T770, LG T770, LP T770 LB T773, LV T773, LT T773, LW T773 LH T774 LS E675, LA E675, LY E675, LS T675 LS T776, LA T776, LO T776, LY T776, LB T776 LHGB T686 LT T68C, LB T68C - Hyper Mini TOPLED® LB M676 - Mini TOPLED Santana® LG M470 LS M47K, LO M47K, LY M47K Source: http://www.osram.convergy.de LUXEON: - LUMILED® LXK2-PW12-R00, LXK2-PW12-S00, LXK2-PW14-U00, LXK2-PW14-V00 LXK2-PM12-R00, LXK2-PM12-S00, LXK2-PM14-U00 LXK2-PE12-Q00, LXK2-PE12-R00, LXK2-PE12-S00, LXK2-PE14-T00, LXK2-PE14-U00 LXK2-PB12-K00, LXK2-PB12-L00, LXK2-PB12-M00, LXK2-PB14-N00, LXK2-PB14-P00, LXK2-PB14-Q00 LXK2-PR12-L00, LXK2-PR12-M00, LXK2-PR14-Q00, LXK2-PR14-R00 LXK2-PD12-Q00, LXK2-PD12-R00, LXK2-PD12-S00 LXK2-PH12-R00, LXK2-PH12-S00 LXK2-PL12-P00, LXK2-PL12-Q00, LXK2-PL12-R00 Source: www.luxeon.com KINGBRIGHT: KA-3528ASYC Source: www.kingbright.com
OK1 = optocoupler:6N138: MOTOROLA OPTO COUPLER
Q1 = crystal:CRYSTAL: CRYSTAL
R1-R27 R32-R35 = rcl:R-US_: RESISTOR, American symbol
R28-R31 R37-R41 = pot-alps:POT_US
R36 = rcl:R-TRIMM: Trimm resistor
RN1 = resistor-sil:G06R: SIL RESISTOR
RN2 = resistor-sil:G08R: SIL RESISTOR
S1-S8 = og-switch:40-XX: OMRON SWITCH
SW = SparkFun:M02: Header 2 Standard 2-pin 0.1" header. Use with straight break away headers (SKU : PRT-00116), right angle break away headers (PRT-00553), swiss pins (PRT-00743), machine pins (PRT-00117), and female headers (PRT-00115). Molex polarized connector foot print use with SKU : PRT-08233 with associated crimp pins and housings.
SW1 = switch-alps:EC12E_SW: ALPS rotary Encoder EC12E series with switch
U1 = SparkFun:AVR_SPI_PRG_6: AVR ISP 6 Pin This is the reduced ISP connector for AVR programming. Common on Arduino. This footprint will take up less PCB space and can be used with a 10-pin to 6-pin adapter such as SKU: BOB-08508
U$22 = og-lcd:LCD_MODULE: Character LCD module
U$26 = adafruit:SDMMC: SD MMC Card holder 4UCON part #06132 - easy to solder
X1 X2 = og-midi:MAB5SH: Female CONNECTOR 5 pins 90 deg. with shield, horizontal (DIN 41524)

## Board
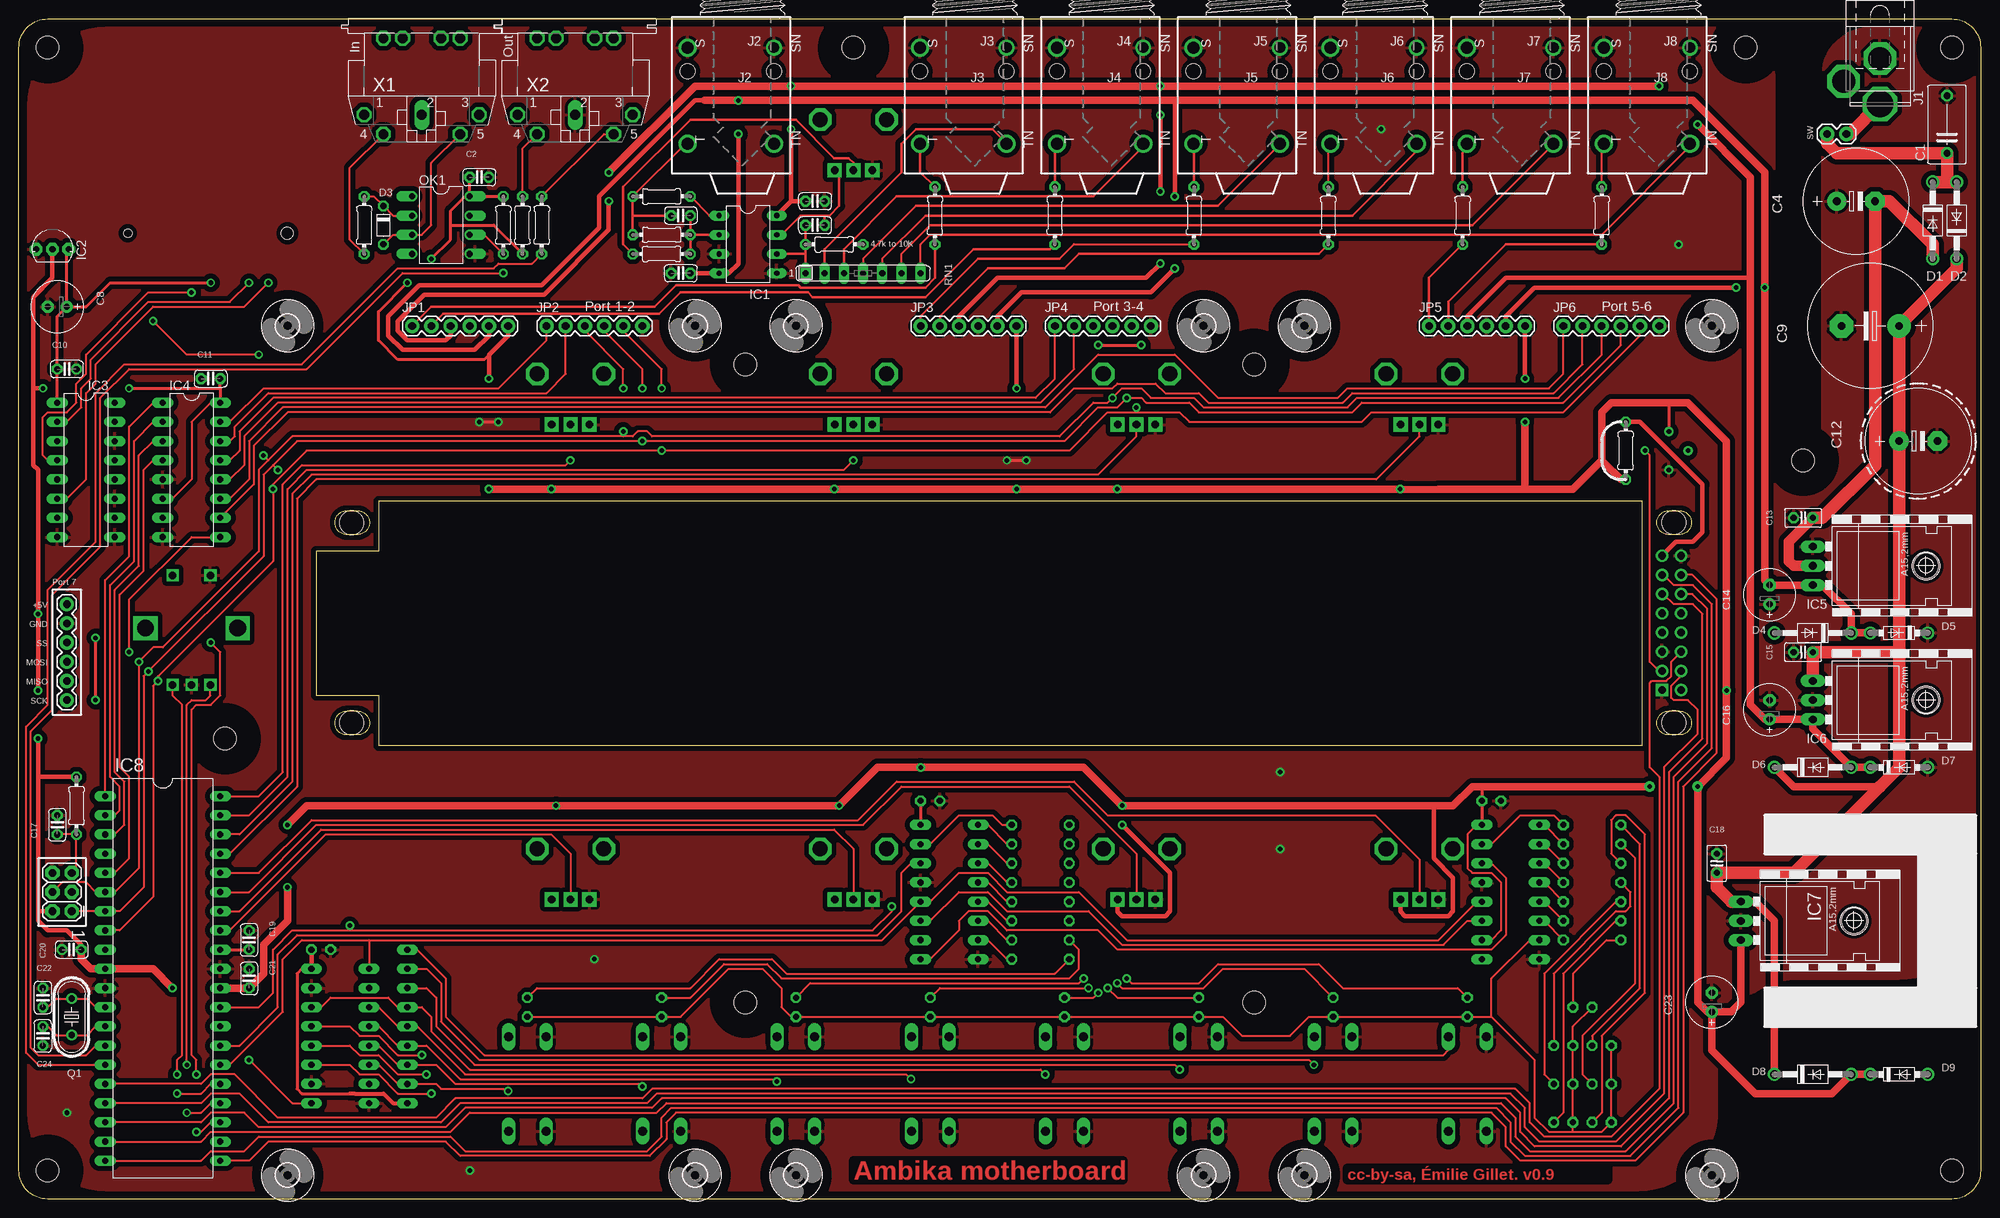
[diagram p5: board, top side]
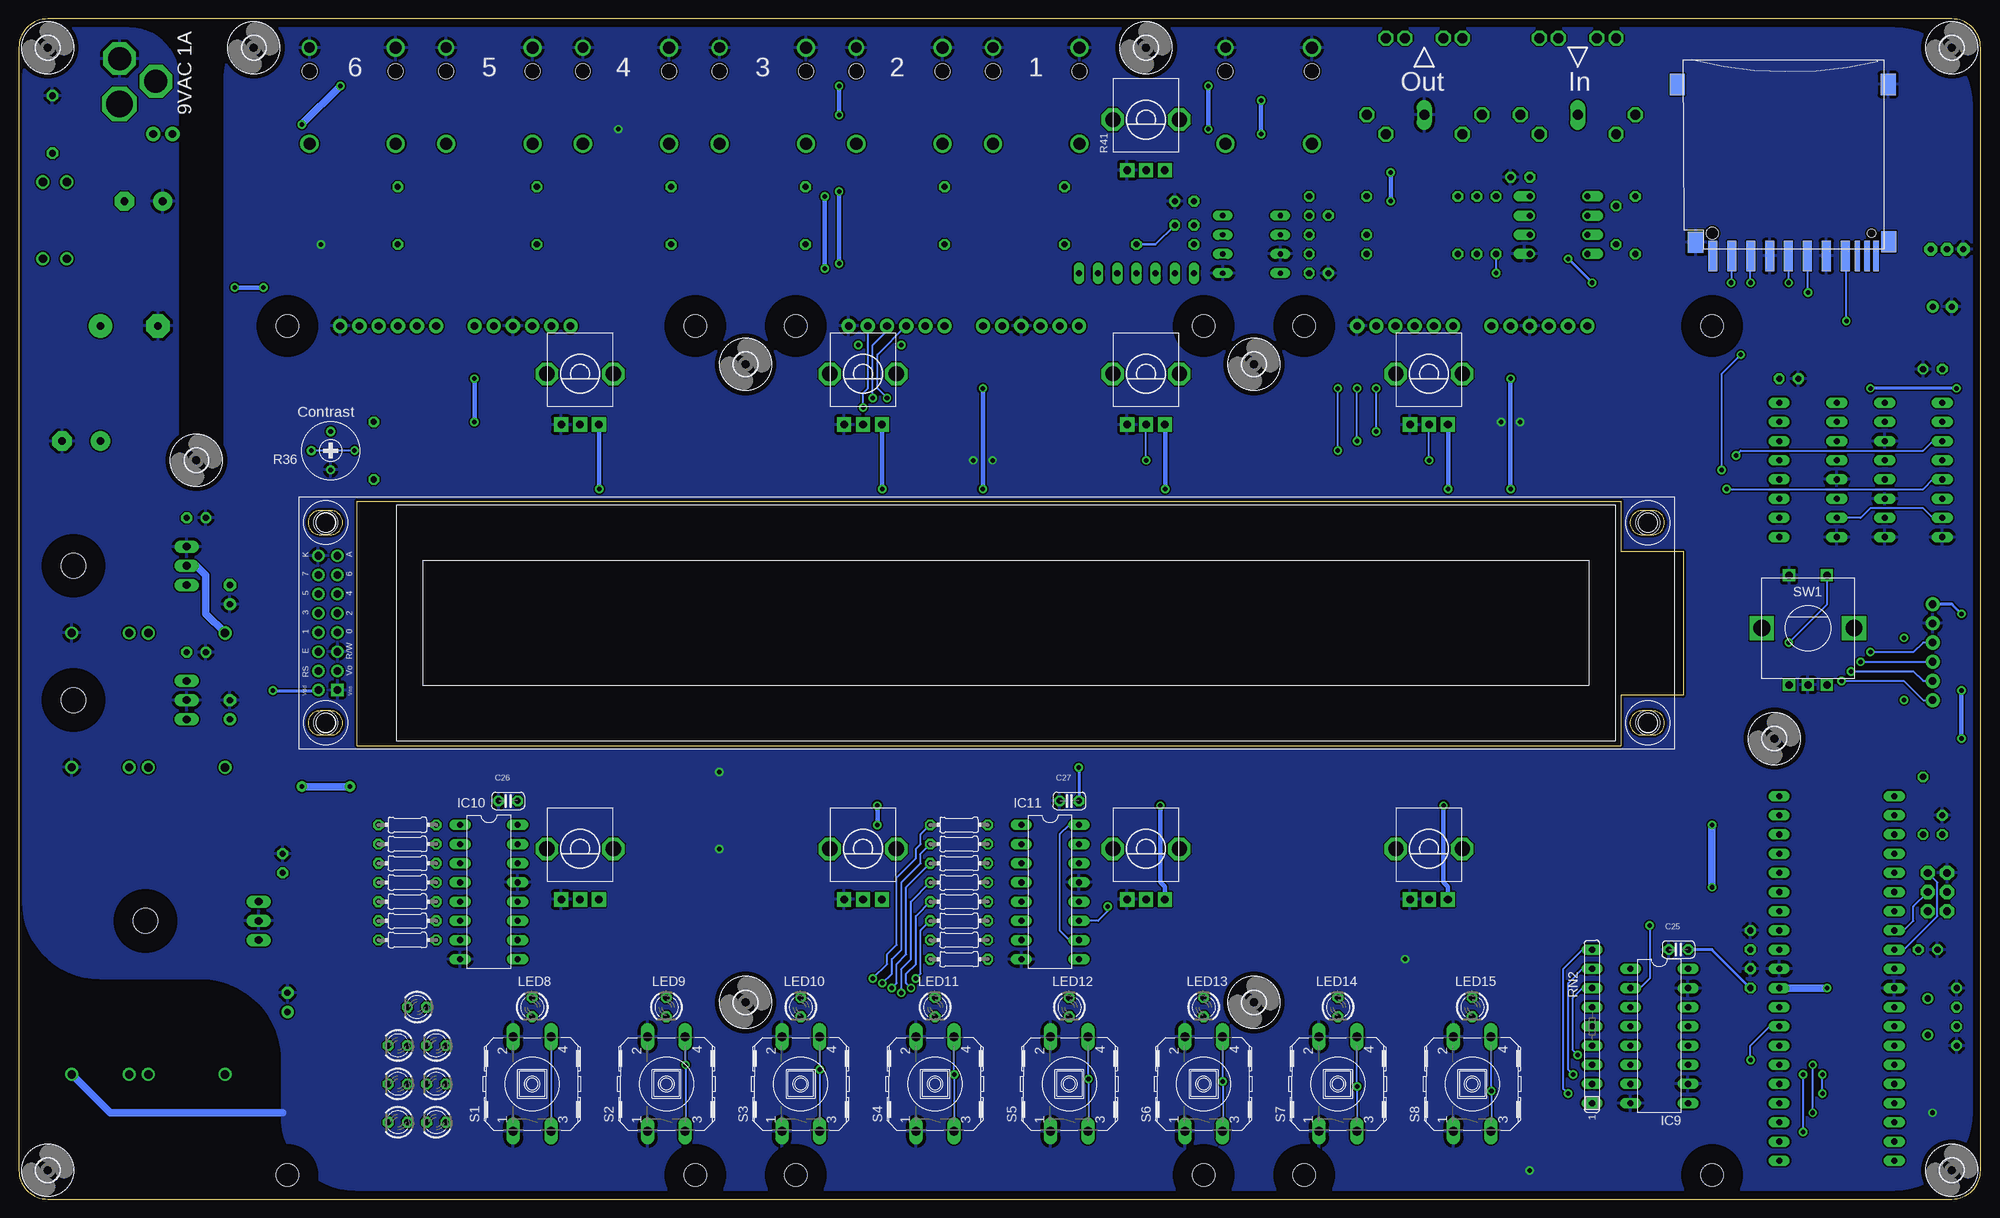
[diagram p6: board, bottom side, seen from below]

Size 259.71 x 156.21 mm. Coordinates in mm from the lower left corner, seen from the top.
Outline: 0,152.4 arc-90 3.81,156.21 255.91,156.21 arc-90 259.71,152.4 259.71,3.81 arc-90 255.91,0 3.81,0 arc-90 0,3.81 0,152.4
Outline: 214.95,60.01 214.95,92.39 47.62,92.39 47.62,85.72 39.37,85.72 39.37,66.67 47.62,66.67 47.62,60.01 214.95,60.01
Copper layers (1*16): Top 0.035mm / dielectric 1.5mm / Bottom 0.035mm
Design rules "SparkFun *": minimum track width 8mil, minimum drill 20mil, track to track 8mil, track to pad 8mil, pad to pad 8mil, via to via 8mil, smd to smd 8mil, copper to edge 10mil, drill to drill 8mil, minimum pad ring 12mil, minimum via ring 10mil, stop-mask expansion 4mil, vias tented up to drill 25mil, thermal gap 16mil

### Footprints (pad centres in the part's own frame; a part is rotated, then mirrored left to right if it is on the bottom)
C075-052X106 = drill 0.914 octagon: 1 -3.81,0; 2 3.81,0
C025-024X044 = drill 0.813 octagon: 1 -1.27,0; 2 1.27,0
E5-13 = drill 1.016 pad 2.54: + -2.54,0 | drill 1.016 pad 2.54 octagon: - 2.54,0
E2,5-7 = drill 0.813 pad 1.6: + -1.27,0 | drill 0.813 pad 1.6 octagon: - 1.27,0
E7,5-16 = drill 1.016 pad 3.15: + -3.81,0 | drill 1.016 pad 3.15 octagon: - 3.81,0
C025-025X050 = drill 0.813 octagon: 1 -1.27,0; 2 1.27,0
DO41-10 = drill 1.118: A 5.08,0; C -5.08,0
D-5 = drill 0.813 octagon: A 2.54,0; C -2.54,0
DO41-7.6 = drill 1.1 pad 1.7: A 3.81,0; C -3.81,0
DIL08 = drill 0.7 long: 1 -3.81,-3.81; 2 -1.27,-3.81; 3 1.27,-3.81; 4 3.81,-3.81; 5 3.81,3.81; 6 1.27,3.81; 7 -1.27,3.81; 8 -3.81,3.81
TO92-INLINE = drill 0.813 pad 1.676 octagon: 1 -2.159,0; 2 0,0; 3 2.159,0
DIL16 = drill 0.813 long: 1 -8.89,-3.81; 2 -6.35,-3.81; 3 -3.81,-3.81; 4 -1.27,-3.81; 5 1.27,-3.81; 6 3.81,-3.81; 7 6.35,-3.81; 8 8.89,-3.81; 9 8.89,3.81; 10 6.35,3.81; 11 3.81,3.81; 12 1.27,3.81; 13 -1.27,3.81; 14 -3.81,3.81; 15 -6.35,3.81; 16 -8.89,3.81
79XXL = drill 1.016 long: GND -2.54,-3.81; IN 0,-3.81; OUT 2.54,-3.81 | hole 3.302: 0,11.176
78XXL = drill 1.016 long: GND 0,-3.81; IN -2.54,-3.81; OUT 2.54,-3.81 | hole 3.302: 0,11.176
DIL40 = drill 0.813 long: 1 -24.13,-7.62; 2 -21.59,-7.62; 3 -19.05,-7.62; 4 -16.51,-7.62; 5 -13.97,-7.62; 6 -11.43,-7.62; 7 -8.89,-7.62; 8 -6.35,-7.62; 9 -3.81,-7.62; 10 -1.27,-7.62; 11 1.27,-7.62; 12 3.81,-7.62; 13 6.35,-7.62; 14 8.89,-7.62; 15 11.43,-7.62; 16 13.97,-7.62; 17 16.51,-7.62; 18 19.05,-7.62; 19 21.59,-7.62; 20 24.13,-7.62; 21 24.13,7.62; 22 21.59,7.62; 23 19.05,7.62; 24 16.51,7.62; 25 13.97,7.62; 26 11.43,7.62; 27 8.89,7.62; 28 6.35,7.62; 29 3.81,7.62; 30 1.27,7.62; 31 -1.27,7.62; 32 -3.81,7.62; 33 -6.35,7.62; 34 -8.89,7.62; 35 -11.43,7.62; 36 -13.97,7.62; 37 -16.51,7.62; 38 -19.05,7.62; 39 -21.59,7.62; 40 -24.13,7.62
SPC4078_BIG_HOLES = drill 3.023 pad 4.318 octagon: 1 -0.46,0; 2 2.54,-4.8 | drill 3.531 pad 4.572 octagon: 3 5.54,0
NRJ4HF = drill 1.6: S 5.08,7.992; T -7.62,7.992; TN -7.62,-3.438 | drill 1.4: SN 5.08,-3.438 | hole 2: 1.948,7.992; 1.948,-3.438
1X06 = drill 1.016 pad 1.88: 1 0,0; 2 2.54,0; 3 5.08,0; 4 7.62,0; 5 10.16,0; 6 12.7,0
LED3MM = drill 0.813 octagon: A -1.27,0; K 1.27,0
DIL08' = drill 0.813 offset: 1 -3.81,-3.81; 2 -1.27,-3.81; 3 1.27,-3.81; 4 3.81,-3.81; 5 3.81,3.81; 6 1.27,3.81; 7 -1.27,3.81; 8 -3.81,3.81
HC49U-V = drill 0.813: 1 -2.413,0; 2 2.413,0
0204/7 = drill 0.813 octagon: 1 -3.81,0; 2 3.81,0
ALPS_POT_VERTICAL = drill 1 pad 1.88 square: P$1 -2.5,6.7; P$2 0,6.7; P$3 2.5,6.7 | drill 2 octagon: P$4 -4.4,0; P$5 4.4,0
RTRIM3339P = drill 0.61: 1 -2.54,0; 2 0,-2.54; 3 2.54,0
SIL7 = drill 0.813 long: 1 -7.62,0; 2 -5.08,0; 3 -2.54,0; 4 0,0; 5 2.54,0; 6 5.08,0; 7 7.62,0
SIL9 = drill 0.813 long: 1 -10.16,0; 2 -7.62,0; 3 -5.08,0; 4 -2.54,0; 5 0,0; 6 2.54,0; 7 5.08,0; 8 7.62,0; 9 10.16,0
B3F-40XX = drill 1.194 long: 1 -6.248,2.489; 2 6.248,2.489; 3 -6.248,-2.489; 4 6.248,-2.489
1X02 = drill 1.016 pad 1.88: 1 0,0; 2 2.54,0
ALPS_EC12E_SW = drill 1 square: A -2.5,-7.5; B 2.5,-7.5; C 0,-7.5; D -2.5,7; E 2.5,7 | drill 2.2 square: GND1 -6.1,0; GND2 6.1,0
2X3 = drill 1.016 pad 1.88 octagon: 1 0,0; 2 0,2.54; 3 2.54,0; 4 2.54,2.54; 5 5.08,0; 6 5.08,2.54
3,0 = hole 3: 0,0
LCD_MODULE_2X40 = drill 1.016 square: 1 1.54,-22.16 | drill 1.016: 2 -1,-22.16; 3 1.54,-19.62; 4 -1,-19.62; 5 1.54,-17.08; 6 -1,-17.08; 7 1.54,-14.54; 8 -1,-14.54; 9 1.54,-12; 10 -1,-12; 11 1.54,-9.46; 12 -1,-9.46; 13 1.54,-6.92; 14 -1,-6.92; 15 1.54,-4.38; 16 -1,-4.38 | hole 3.2: 0,-26.5; 175,-26.5; 175,0; 0,0.018
06132 = smd 1.2 x 4: 1 6.9,0.9; 2 4.4,0.9; 3 1.9,0.9; 4 -0.6,0.9; 5 -3.1,0.9; 6 -5.6,0.9; 7 -8.1,0.9; 9 9.4,0.9 | smd 0.7 x 4: 8 -9.7,0.9; CD -11,0.9; WP -12.2,0.9 | smd 2 x 2.8: GP -13.8,-21.8; GP2 14.1,-21.8; GP3 11.7,-0.9; GP4 -13.9,-1 | hole 1.1: -11.6,-2.1 | hole 1.6: 9.5,-2.1
MAB5SH = drill 1.321 octagon: 1 7.62,7.62; 3 -7.62,7.62; 4 5.08,10.16; 5 -5.08,10.16; P$1 -5.08,-2.54; P$2 -2.54,-2.54; P$3 2.54,-2.54; P$4 5.08,-2.54 | drill 1.321 long: 2 0,7.62

### Placement (x,y rotation side)
C1  255.27,142.24 90 top
C2  60.96,135.25 0 top
C3  105.41,132.08 0 top
C4  243.21,132.08 0 top
C5  87.63,130.18 180 top
C6  105.41,128.91 0 top
C7  87.63,122.55 0 top
C8  5.08,118.11 180 top
C9  245.11,115.57 180 top
C10  6.35,109.86 0 top
C11  25.4,108.58 180 top
C12  251.46,100.33 0 top
C13  236.22,90.17 0 top
C14  231.78,80.01 90 top
C15  236.22,72.39 180 top
C16  231.78,64.77 90 top
C17  5.08,49.53 90 top
C18  224.79,44.45 90 top
C19  30.48,34.29 90 top
C20  6.98,33.02 180 top
C21  30.48,29.21 90 top
C22  3.17,26.67 270 top
C23  224.16,26.04 90 top
C24  3.17,21.59 90 top
C25  40.01,33.02 180 bottom
C26  194.94,52.7 180 bottom
C27  120.65,52.7 180 bottom
D1  253.36,129.54 270 top
D2  256.54,129.54 90 top
D3  48.26,128.91 270 top
D4  237.49,74.93 180 top
D5  248.92,74.93 180 top
D6  237.49,57.15 0 top
D7  248.92,57.15 0 top
D8  237.49,16.51 0 top
D9  248.92,16.51 0 top
IC1  96.52,126.37 270 top
IC2  4.44,125.73 0 top
IC3  8.89,96.52 270 top
IC4  22.86,96.52 270 top
IC5  7908  [79XXL]  241.3,83.82 270 top
IC6  241.3,66.04 270 top
IC7  7805  [78XXL]  231.78,36.83 270 top
IC8  19.05,29.21 270 top
IC9  42.55,21.59 270 bottom
IC10  197.49,40.64 270 bottom
IC11  123.19,40.64 270 bottom
J1  246.38,150.5 270 top
J2  96.52,147.32 90 top
J3  127.32,147.32 90 top
J4  145.41,147.32 90 top
J5  163.51,147.32 90 top
J6  181.61,147.32 90 top
J7  199.71,147.32 90 top
J8  217.81,147.32 90 top
JP1  52.07,115.57 0 top
JP2  69.85,115.57 0 top
JP3  119.38,115.57 0 top
JP4  137.16,115.57 0 top
JP5  186.69,115.57 0 top
JP6  204.47,115.57 0 top
JP7  6.35,66.04 90 top
LED1  209.55,10.16 180 bottom
LED2  204.47,10.16 180 bottom
LED3  209.55,15.24 180 bottom
LED4  204.47,15.24 180 bottom
LED5  209.55,20.32 180 bottom
LED6  204.47,20.32 180 bottom
LED7  207.01,25.4 180 bottom
LED8  191.77,25.4 270 bottom
LED9  173.99,25.4 270 bottom
LED10  156.21,25.4 270 bottom
LED11  138.43,25.4 270 bottom
LED12  120.65,25.4 270 bottom
LED13  102.87,25.4 270 bottom
LED14  85.09,25.4 270 bottom
LED15  67.31,25.4 270 bottom
OK1  6N137  [DIL08']  55.88,128.91 270 top
Q1  6.98,24.13 90 top
R1  85.09,132.72 180 top
R2  121.28,130.18 90 top
R3  137.16,130.18 90 top
R4  155.57,130.18 90 top
R5  173.35,130.18 90 top
R6  191.13,130.18 90 top
R7  209.55,130.18 90 top
R8  45.72,128.91 90 top
R9  64.14,128.91 90 top
R10  66.67,128.91 270 top
R11  69.22,128.91 90 top
R12  85.09,127.63 180 top
R13  107.95,126.37 0 top
R14  85.09,125.09 0 top
R15  212.72,99.06 90 top
R16  7.62,52.07 90 top
R17  135.25,31.75 180 bottom
R18  208.28,34.29 180 bottom
R19  135.25,34.29 180 bottom
R20  208.28,36.83 180 bottom
R21  135.25,36.83 180 bottom
R22  208.28,39.37 180 bottom
R23  135.25,39.37 180 bottom
R24  208.28,41.91 180 bottom
R25  135.25,41.91 180 bottom
R26  208.28,44.45 180 bottom
R27  135.25,44.45 180 bottom
R28  185.42,46.35 180 bottom
R29  147.96,46.35 180 bottom
R30  110.49,46.35 180 bottom
R31  73.03,46.35 180 bottom
R32  208.28,46.99 180 bottom
R33  135.25,46.99 180 bottom
R34  208.28,49.53 180 bottom
R35  135.25,49.53 180 bottom
R36  218.44,99.06 270 bottom
R37  185.42,109.22 180 bottom
R38  147.96,109.22 180 bottom
R39  110.49,109.22 180 bottom
R40  73.03,109.22 180 bottom
R41  110.49,142.88 180 bottom
RN1  111.76,122.55 0 top
RN2  51.44,22.86 90 bottom
S1  191.77,15.24 90 bottom
S2  173.99,15.24 90 bottom
S3  156.21,15.24 90 bottom
S4  138.43,15.24 90 bottom
S5  120.65,15.24 90 bottom
S6  102.87,15.24 90 bottom
S7  85.09,15.24 90 bottom
S8  67.31,15.24 90 bottom
SW  241.94,140.97 180 top
SW1  22.86,75.56 0 bottom
U1  6.98,38.1 90 top
U$1  [V2_LOGO]  8.89,121.92 0 top
U$2  [3,0]  35.56,115.57 0 top
U$3  [3,0]  89.53,115.57 0 top
U$4  [3,0]  102.87,115.57 0 top
U$5  [3,0]  156.84,115.57 0 top
U$6  [3,0]  170.18,115.57 0 top
U$7  [3,0]  224.16,115.57 0 top
U$8  [D02A-L]  247.02,83.82 180 top
U$9  [D02A-L]  247.02,66.04 180 top
U$10  [D02A-L]  237.49,36.83 180 top
U$11  [3,0]  35.56,3.18 0 top
U$12  [3,0]  89.53,3.18 0 top
U$13  [3,0]  102.87,3.18 0 top
U$14  [3,0]  156.84,3.18 0 top
U$15  [3,0]  170.18,3.18 0 top
U$16  [3,0]  224.16,3.18 0 top
U$17  [3,0]  255.91,3.81 0 bottom
U$18  [3,0]  3.81,3.81 0 bottom
U$19  [3,0]  163.51,26.04 0 bottom
U$20  [3,0]  96.2,26.04 0 bottom
U$21  [3,0]  27.3,60.96 0 bottom
U$22  219.07,89.53 0 bottom
U$23  [3,0]  236.22,97.79 0 bottom
U$24  [3,0]  163.51,110.49 0 bottom
U$25  [3,0]  96.2,110.49 0 bottom
U$26  26.04,125.73 180 bottom
U$27  [3,0]  255.91,152.4 0 bottom
U$28  [3,0]  228.6,152.4 0 bottom
U$29  [3,0]  110.49,152.4 0 bottom
U$30  [3,0]  3.81,152.4 0 bottom
X1  53.34,151.13 180 top
X2  73.66,151.13 180 top

### Tracks (layer width: path | path; a pad name or v marks a point on that pad's centre or on a via)
+3V3  (via drill 0.6)
  Top 0.406: IC3.1 C10.1 5.08,116.84 C8.+ | IC2.3 6.35,125.48 C8.+ | C8.+ 8.89,118.11 12.06,121.28 v25.4,121.28
  Bottom 0.254: 25.44,125.13 U$26.4 25.4,124.79 v25.4,121.28
+5V  (via drill 0.6, 0.6 pad 1.42)
  Top 0.254: IC4.6 20.32,92.71 22.86,95.25 22.86,102.87 25.4,105.41 | IC10.10 194.94,34.29 196.22,35.56 196.22,41.91 194.94,43.18 192.41,43.18 191.77,43.81 191.77,48.26 193.04,49.53
  Top 0.406: OK1.8 R9.2 | C27.1 IC11.16 | 44.45,13.97 37.47,13.97 36.83,14.6 36.83,29.85 37.47,30.48 IC9.16 | 193.04,49.53 IC10.16 C26.1 193.68,54.61 | 25.4,105.41 IC4.16 26.67,107.31 | OK1.8 C2.1 | v51.44,121.28 47.62,117.47 47.62,113.66 50.17,111.12 61.59,111.12 62.23,111.76 | v54.61,124.46 57.15,127 57.15,128.91 | 57.15,128.91 57.15,130.81 59.06,132.72 OK1.8 | v14.6,107.31 26.67,107.31 | 26.67,107.31 C11.1 | R10.2 62.86,128.91 57.15,128.91 | 218.44,105.41 R36.1
  Top 0.508: 43.81,13.97 44.45,13.97 48.26,13.97 49.53,12.7 RN2.1
  Top 0.61: C25.1 IC9.16 | v199.39,108.58 JP5.6 | v132.08,107.31 JP3.6 | v2.54,67.31 v2.54,77.47 2.54,96.52 1.9,97.16 1.9,107.31 | v62.23,108.58 62.23,111.76 64.77,114.3 JP1.6 | C20.1 8.26,33.66 6.35,35.56 3.81,35.56 2.54,36.83 2.54,38.1 | 2.54,38.1 2.54,55.88 | 2.54,55.88 v2.54,60.96 | 2.54,38.1 U1.2 | 2.54,55.88 R16.2 | 1.9,107.31 v3.17,107.31 | 1.9,107.31 1.9,119.38 4.44,121.92 IC2.2 | R28.P$1 182.88,39.61 182.88,38.1 183.52,37.46 189.23,37.46 189.87,38.1 189.87,42.54 187.32,45.09 187.32,52.07 | v146.05,49.53 152.4,43.18 152.4,38.1 151.77,37.46 146.05,37.46 145.46,38.06 R29.P$1
  Top 0.914: v182.88,93.98 187.96,93.98
  Top 1.016: v20.32,27.94 17.78,30.48 IC8.10 9.53,30.48 8.26,31.75 C20.1 | v35.56,49.53 38.1,52.07 v71.12,52.07 v108.59,52.07 113.67,57.15 v119.38,57.15 140.97,57.15 v146.05,52.07 187.32,52.07 189.87,52.07 192.41,54.61 193.68,54.61 v215.9,54.61 214,54.61 | v35.56,41.27 35.56,36.83 32.38,33.66 32.38,29.85 C21.1 IC8.30 | v182.88,93.98 v145.41,93.98 v132.08,93.98 v107.95,93.98 v70.48,93.98 v62.23,93.98 | 187.96,93.98 199.39,93.98 | 199.39,93.98 v199.39,102.87 | C23.+ 223.52,24.77 222.25,26.04 v222.25,54.61 226.06,58.42 v226.06,67.31 226.06,100.33 220.98,105.41 218.44,105.41 210.82,105.41 209.55,104.14 209.55,97.79 209.23,97.47 | IC7.OUT 227.97,26.04 226.69,24.77 C23.+ | D9.C D8.A 240.03,13.97 229.87,13.97 224.16,19.69 C23.+ | 199.39,93.98 205.74,93.98 209.23,97.47 | R15.1 212.09,95.25 209.87,97.47 209.23,97.47
  Bottom 0.254: IC11.10 120.65,34.29 121.92,35.56 121.92,48.26 120.65,49.53
  Bottom 0.406: v119.38,57.15 C27.1 | IC11.16 120.65,49.53 | v2.54,77.47 3.81,78.74 JP7.6 | v51.44,121.28 v54.61,124.46 | v3.17,107.31 v14.6,107.31 | C25.1 35.56,33.02 C21.1 | v226.06,67.31 220.14,67.31
  Bottom 0.61: R40.P$1 70.48,102.48 v70.48,93.98 70.53,94.02 | v71.12,52.07 71.12,41.91 70.53,41.31 R31.P$1 | v108.59,52.07 108.59,41.91 107.99,41.31 R30.P$1 | v107.95,93.98 107.95,102.48 R39.P$1 | v145.41,93.98 145.41,102.48 R38.P$1 | v182.88,93.98 182.88,102.48 R37.P$1 | v62.23,93.98 v62.23,108.58 | v199.39,102.87 v199.39,108.58 | v132.08,107.31 v132.08,93.98 | v2.54,60.96 v2.54,67.31 | v146.05,52.07 v146.05,49.53
  Bottom 1.016: IC8.30 v20.32,27.94 | v35.56,49.53 v35.56,41.27 | v222.25,54.61 v215.9,54.61 | 220.14,67.31 U$22.2
AUDIO0
  Top 0.305: JP1.1 54.61,118.11 84.14,118.11 87,120.97 103.19,120.97 103.5,120.65 120.02,120.65 121.28,121.92 R2.1
AUDIO1
  Top 0.305: JP1.2 56.2,117.16 84.77,117.16 87.63,120.02 104.46,120.02 105.09,119.38 120.02,119.38 126.37,125.73 136.53,125.73 R3.1
AUDIO2
  Top 0.254: 139.7,126.37 R4.1
  Top 0.305: JP3.1 119.38,116.84 127,124.46 137.79,124.46 139.7,126.37
AUDIO3
  Top 0.305: JP3.2 121.92,116.84 128.27,123.19 138.43,123.19 140.34,125.09 172.09,125.09 R5.1
AUDIO4
  Top 0.305: JP5.1 186.69,121.92 R6.1
AUDIO5
  Top 0.305: JP5.2 189.23,118.75 196.85,126.37 R7.1
ENC_A  (via drill 0.6)
  Top 0.254: IC8.24 25.4,12.7 24.13,11.43 v22.23,11.43 | v22.23,17.78 22.23,65.41 22.86,66.04 24.77,66.04 25.36,66.63 SW1.A
  Bottom 0.254: v22.23,11.43 v22.23,17.78
ENC_B  (via drill 0.6)
  Top 0.254: IC8.25 25.4,15.24 24.13,13.97 v20.95,13.97 | v20.95,16.51 20.95,18.42 21.59,19.05 21.59,65.41 20.36,66.63 SW1.B
  Bottom 0.254: v20.95,13.97 v20.95,16.51
ENC_CLICK  (via drill 0.6)
  Top 0.254: v25.4,73.66 26.67,72.39 26.67,66.67 25.4,65.41 23.5,65.41 22.86,64.77 22.86,19.05 23.5,18.42 v23.5,16.51 | v23.5,8.89 24.13,8.89 25.4,10.16 IC8.23
  Bottom 0.254: SW1.E 20.32,82.52 20.32,78.74 v25.4,73.66 | v23.5,8.89 v23.5,16.51
GND  (via drill 0.6)
  Top 0.406: v60.96,102.87 v63.5,102.87 | v130.81,97.79 v133.35,97.79
  Bottom 1.016: D9.A 247.65,11.43 224.79,11.43
  other vias: 167,46.35 167,56.52 59.69,3.81 6.35,11.43 76.2,31.75 219.71,126.37 180.34,141.6
  pour Bottom: 301 corners
  pour Top (isolate 0.635): 301 corners
GND1  (via drill 0.6)
  Top 0.406: v142.88,113.03 v148.59,113.03
GND4  (via drill 0.6)
  Top 0.406: v10.16,66.04 v10.16,74.3
IO_ENABLE
  Top 0.254: IC10.12 193.04,39.37 187.96,34.29 146.69,34.29 140.34,40.64 130.81,40.64 128.27,43.18 124.46,43.18 120.65,39.37 IC11.12 114.3,34.29 46.36,34.29 | 46.36,34.29 IC9.1 | IC8.26 27.94,17.78 34.93,24.77 34.93,31.75 37.47,34.29 46.36,34.29
IO_INPUT  (via drill 0.6)
  Top 0.254: v30.48,18.42 36.2,12.7 IC9.9
  Bottom 0.254: IC8.28 27.94,22.86 30.48,20.32 v30.48,18.42
IO_OUTPUT
  Top 0.254: IC11.14 118.11,44.45 116.84,43.18 116.84,38.1 113.67,34.92 36.83,34.92 34.29,32.38 34.29,25.4 29.21,20.32 IC8.27
IO_SCK  (via drill 0.6)
  Top 0.254: IC10.11 191.77,36.83 188.59,33.66 146.05,33.66 141.6,38.1 130.81,38.1 128.27,40.64 124.46,40.64 120.65,36.83 IC11.11 | v115.57,38.73 115.57,38.1 113.03,35.56 43.81,35.56 | 43.81,35.56 v43.81,36.2 | IC8.29 31.75,25.4 33.66,27.3 33.66,33.02 36.2,35.56 43.81,35.56
  Bottom 0.254: IC9.2 45.09,27.94 43.81,29.21 v43.81,36.2 | v115.57,38.73 115.57,38.1 116.84,36.83 IC11.11
LCD_DATA4
  Top 0.254: IC8.18 24.13,10.16 25.4,11.43 29.84,11.43 31.75,9.53 56.52,9.53 59.06,12.06 83.82,12.06 85.09,13.33 196.85,13.33 198.75,11.43 198.75,8.89 200.66,6.98 212.09,6.98 218.44,13.33 218.44,56.52 222.88,60.96 222.88,77.47 221.62,78.74 219.07,78.74 217.74,80.08 U$22.11
LCD_DATA5
  Top 0.254: IC8.19 24.13,7.62 25.4,8.89 57.15,8.89 59.69,11.43 84.45,11.43 85.72,12.7 196.22,12.7 198.12,10.79 198.12,8.25 200.03,6.35 212.72,6.35 219.07,12.7 219.07,55.88 223.52,60.33 223.52,78.11 221.55,80.08 U$22.12
LCD_DATA6
  Top 0.254: IC8.20 24.13,5.08 25.4,6.35 29.84,6.35 31.75,8.25 57.15,8.25 59.06,6.35 83.19,6.35 85.09,8.25 85.09,10.79 86.36,12.06 195.58,12.06 197.49,10.16 197.49,7.62 199.39,5.71 213.36,5.71 219.71,12.06 219.71,55.24 224.16,59.69 224.16,78.74 221.62,81.28 219.07,81.28 217.74,82.61 U$22.13
LCD_DATA7
  Top 0.254: U$22.14 221.55,82.61 224.79,79.38 224.79,59.05 220.34,54.61 220.34,11.43 214,5.08 198.75,5.08 196.85,6.98 196.85,9.53 194.94,11.43 87,11.43 85.72,10.16 85.72,7.94 83.5,5.71 58.42,5.71 56.52,7.62 33.02,7.62 30.48,5.08 IC8.21
LCD_ENABLE
  Top 0.254: IC8.16 24.13,15.24 25.4,16.51 28.58,16.51 34.29,10.79 55.25,10.79 57.78,13.33 82.55,13.33 83.82,14.6 198.12,14.6 200.03,12.7 200.03,10.16 201.93,8.25 210.82,8.25 217.17,14.6 217.17,55.88 215.9,57.15 215.9,68.26 216.22,68.58 218.12,68.58 218.76,69.22 218.76,71.12 220.07,72.44 U$22.6
LCD_RS
  Top 0.254: IC8.17 24.13,12.7 25.4,13.97 29.21,13.97 33.02,10.16 55.88,10.16 58.42,12.7 83.19,12.7 84.45,13.97 197.49,13.97 199.39,12.06 199.39,9.53 201.29,7.62 211.46,7.62 217.81,13.97 217.81,57.15 222.25,61.59 222.25,64.77 220.98,66.04 219.07,66.04 218.76,66.36 218.76,67.94 220.07,69.26 U$22.4 220.07,69.9
MIDI_IN  (via drill 0.6)
  Top 0.254: IC8.14 10.16,20.32 8.89,19.05 2.54,19.05 1.59,20 1.59,61.91 4.44,64.77 4.44,80.01 10.79,86.36 10.79,106.05 14.6,109.86 38.1,109.86 50.8,122.55 v64.14,122.55 | OK1.6 61.59,127.63 R9.1
  Bottom 0.254: v64.14,122.55 R9.1
MIDI_OUT
  Top 0.254: IC8.15 2.54,17.78 0.95,19.37 0.95,62.55 3.81,65.41 3.81,80.64 10.16,87 10.16,106.68 13.97,110.49 37.47,110.49 50.17,123.19 62.86,123.19 63.5,123.83 67.95,123.83 R11.1
MISO  (via drill 0.6)
  Top 0.254: 33.66,97.16 36.83,100.33 v82.55,100.33 138.43,100.33 142.88,104.77 145.41,104.77 v146.69,106.05 148.59,106.05 149.22,105.41 154.94,105.41 156.21,104.14 176.53,104.14 177.8,105.41 204.47,105.41 212.09,113.03 JP6.4 | 33.66,97.16 32.38,95.88 32.38,85.09 v17.14,69.85 16.51,69.22 16.51,41.27 13.33,38.1 IC8.7 U1.1 | 33.66,97.16 v34.29,96.52 | v82.55,107.31 82.55,109.86 77.47,114.94 JP2.4 | v17.78,116.2 22.23,111.76 v31.75,111.76
  Bottom 0.254: v146.69,106.05 146.69,113.03 144.78,114.94 JP4.4 | U$26.7 17.94,124.62 17.78,124.46 v17.78,116.2 | JP7.2 7.62,68.58 8.89,69.85 v17.14,69.85 | v82.55,100.33 v82.55,107.31 | v31.75,111.76 34.29,109.22 v34.29,96.52
MOSI  (via drill 0.6)
  Top 0.254: 80.01,100.97 81.28,100.97 81.92,101.6 83.19,101.6 83.82,100.97 137.79,100.97 142.24,105.41 144.15,105.41 v144.78,106.05 146.05,107.31 148.59,107.31 149.86,106.05 155.57,106.05 156.84,104.77 175.9,104.77 177.16,106.05 203.84,106.05 209.55,111.76 JP6.3 | 80.01,100.97 36.2,100.97 33.02,97.79 | U1.4 5.71,41.91 8.89,41.91 10.16,40.64 IC8.6 12.7,40.64 15.87,43.81 v15.87,71.12 17.78,73.02 19.05,73.02 31.75,85.72 31.75,96.52 33.02,97.79 | 80.01,100.97 v80.01,101.6 | 33.02,97.79 v32.38,98.42 | JP2.3 74.93,114.94 80.01,109.86 v80.01,107.31
  Bottom 0.254: v144.78,106.05 146.05,107.31 146.05,111.76 JP4.3 | v15.87,71.12 JP7.3 | IC3.3 6.35,100.33 7.62,99.06 31.75,99.06 v32.38,98.42 | v80.01,101.6 v80.01,107.31
MOSI_3V3  (via drill 0.6)
  Top 0.254: v30.48,121.28 27.94,118.75 17.14,118.75 9.53,111.12 9.53,108.58 8.26,107.31 8.26,104.77 6.35,102.87 IC3.2
  Bottom 0.254: v30.48,121.28 30.48,124.78 U$26.2
N$1
  Top 0.254: IC11.2 128.27,46.99 130.81,44.45 R27.1
N$2  (via drill 0.6)
  Top 0.254: IC9.3 47.62,25.4 50.17,22.86 RN2.5 52.7,22.86 59.06,16.51 117.47,16.51 v118.11,15.87 118.16,15.87
  Bottom 0.254: S5.4 118.11,21.44 v118.11,15.87 118.11,9.04 S5.3
N$3  (via drill 0.6)
  Top 0.254: IC9.5 47.62,20.32 50.17,17.78 RN2.3 55.25,17.78 57.78,15.24 82.23,15.24 v82.55,14.92
  Bottom 0.254: S7.3 82.6,9.47 82.55,9.53 v82.55,14.92 82.55,21.44 S7.4
N$4
  Top 1.676: J1.3 242.4,140.97 SW.1
N$5
  Top 0.254: R11.2 77.47,140.97 X2.5
N$6
  Top 0.305: IC1.7 100.97,127.63 103.5,130.18 106.68,130.18 | C6.2 106.68,130.18 | R41.P$1 108.59,135.58 108.59,131.44 107.31,130.18 106.68,130.18
  Bottom 0.305: C6.2 109.22,126.37 R13.2
N$7
  Top 0.406: IC8.32 C19.1
N$9
  Top 0.305: RN1.1 104.14,125.09 | 104.14,125.09 R13.1 C6.1 | 104.14,125.09 IC1.6
N$10  (via drill 0.6)
  Top 0.254: IC9.4 47.62,22.86 50.17,20.32 RN2.4 53.97,20.32 58.42,15.87 100.01,15.87 v100.33,15.56
  Bottom 0.254: S6.4 100.33,21.44 v100.33,15.56 100.33,9.04 S6.3
N$12  (via drill 0.6)
  Top 0.254: IC9.14 40.01,25.4 41.27,26.67 48.9,26.67 50.17,25.4 RN2.6 53.34,25.4 54.61,24.13 54.61,22.23 59.69,17.14 135.25,17.14 v135.89,16.51 135.94,16.51
  Bottom 0.254: S4.3 135.89,9.04 v135.89,16.51 135.89,21.44 S4.4
N$13
  Top 0.305: R41.P$2 110.49,137.16 109.86,137.79 107.95,137.79 102.87,142.88 88.9,142.88 80.01,133.98 80.01,126.37 R14.1
N$15
  Top 0.305: R12.1 IC1.2 | R14.2 R12.1 | R12.1 C5.1
N$16
  Top 0.305: R12.2 81.28,130.18 | 81.28,130.18 C5.2 | J2.T 88.27,139.7 R1.2 81.28,130.18
N$18  (via drill 0.6)
  Top 0.254: U$22.3 217.1,69.91 215.9,71.12 215.9,98.42 v215.27,99.06
  Bottom 0.254: v215.27,99.06 R36.2
N$19
  Top 0.305: R2.2 119.33,135.94 J3.T
N$20
  Top 1.422: IC5.IN 234.95,83.82 234.31,84.45 234.31,87 C13.2
  Top 1.676: C13.2 238.76,90.17 245.74,97.16 C4.- 247.65,132.08 253.36,126.37 D1.A
  Bottom 1.016: D4.A 234.95,77.47 234.95,82.55 236.22,83.82 IC5.IN
N$24  (via drill 0.6)
  Top 0.254: IC9.11 43.81,17.78 45.09,16.51 47.62,16.51 50.17,13.97 v54.61,13.97 | RN2.9 52.7,33.02 56.52,29.21 56.52,24.13 61.59,19.05 188.59,19.05 189.28,19.74 S1.4
  Bottom 0.254: v54.61,13.97 55.25,14.6 55.25,30.48 52.7,33.02 RN2.9 | S1.4 S1.3
N$25
  Top 1.016: D6.C 234.95,54.61 246.38,54.61 | D8.C 232.41,36.83 229.87,39.37 IC7.IN
  Top 1.676: IC6.IN C15.1 248.92,72.39 | 248.92,72.39 248.92,57.15 246.38,54.61 234.95,43.18 C18.1 224.79,41.27 226.69,39.37 IC7.IN | 248.92,72.39 C12.+ C9.+ 256.54,123.19 D2.C
N$28
  Top 0.254: R8.2 46.99,132.72 D3.C 49.53,130.18 OK1.2
N$29
  Top 1.676: 255.27,134.62 C1.1 240.66,138.43 239.4,139.7 SW.2 | 255.27,134.62 D2.A | 255.27,134.62 D1.C
N$30
  Top 0.254: IC11.15 120.65,46.99 124.46,50.8 128.91,50.8 130.18,49.53 R35.1
N$31
  Top 0.254: IC11.1 128.27,49.53 130.81,46.99 R33.1
N$32
  Top 0.305: R3.2 137.16,139.06 137.42,139.33 J4.T
N$33
  Top 0.254: IC11.3 128.27,44.45 130.81,41.91 R25.1
N$34
  Top 0.254: IC11.4 128.27,41.91 130.81,39.37 R23.1
N$35
  Top 0.254: IC11.5 128.27,39.37 130.81,36.83 R21.1
N$36
  Top 0.254: IC11.7 128.27,34.29 130.81,31.75 R17.1
N$37
  Top 0.254: IC11.6 128.27,36.83 130.81,34.29 R19.1
N$40
  Top 0.254: 155.57,139.06 155.52,139.12
  Top 0.305: R4.2 155.57,139.06 | 155.52,139.12 J5.T
N$42  (via drill 0.6)
  Top 0.254: LED8.A 190.5,27.94 175.26,27.94 172.09,31.11 158.75,31.11 156.21,28.57 147.32,28.57 v146.69,29.21
  Bottom 0.254: R35.2 140.34,48.26 140.34,46.99 140.97,46.35 140.97,45.09 143.51,42.54 143.51,33.66 144.78,32.38 144.78,31.11 v146.69,29.21
N$43  (via drill 0.6)
  Top 0.254: v145.41,28.57 146.05,27.94 156.84,27.94 159.38,30.48 170.18,30.48 LED9.A
  Bottom 0.254: R33.2 140.34,45.72 140.34,44.45 142.88,41.91 142.88,33.02 144.15,31.75 144.15,29.85 v145.41,28.57
N$44  (via drill 0.6)
  Top 0.254: LED10.A 145.41,26.67 v144.15,27.94
  Bottom 0.254: R27.2 142.24,41.27 142.24,32.38 143.51,31.11 143.51,28.57 v144.15,27.94
N$45  (via drill 0.6)
  Top 0.254: LED11.A 142.24,26.67 v142.88,27.3
  Bottom 0.254: R25.2 141.6,39.37 141.6,31.75 142.88,30.48 v142.88,27.3
N$46  (via drill 0.6)
  Top 0.254: v141.6,27.94 121.92,27.94 LED12.A
  Bottom 0.254: v141.6,27.94 142.24,28.57 142.24,29.85 140.97,31.11 140.97,37.46 R23.2
N$47  (via drill 0.6)
  Top 0.254: LED13.A 104.78,28.57 140.34,28.57 v140.97,29.21
  Bottom 0.254: v140.97,29.21 140.34,29.85 140.34,35.56 R21.2
N$48
  Top 0.254: LED14.A 88.9,26.67 93.34,31.11 99.06,31.11 100.97,29.21 139.06,29.21 140.34,30.48 140.34,33.02 R19.2
N$49
  Top 0.254: LED15.A 68.58,27.94 88.9,27.94 92.71,31.75 99.7,31.75 101.6,29.85 137.16,29.85 R17.2
N$51
  Top 0.254: LED15.K LED14.K 87.63,24.13 93.98,30.48 98.42,30.48 100.97,27.94 100.97,25.4 102.23,24.13 LED13.K LED12.K LED11.K LED10.K 159.38,24.13 161.93,21.59 168.28,21.59 170.81,24.13 LED9.K LED8.K 194.94,24.13 | LED5.K LED3.K LED1.K 209.55,8.89 205.74,8.89 | 205.74,8.89 LED2.K LED4.K LED6.K 205.74,22.86 LED7.K | 205.74,8.89 202.56,8.89 200.66,10.79 200.66,18.42 194.94,24.13 | IC10.7 200.03,34.29 194.94,29.21 194.94,24.13
N$57
  Top 0.254: R5.2 173.35,139.06 173.62,139.33 J6.T
N$62
  Top 0.254: IC10.15 194.94,46.99 198.75,50.8 203.2,50.8 R34.1
N$63
  Top 0.254: IC10.1 201.93,49.53 R32.1
N$64
  Top 0.305: R6.2 191.13,138.43 191.72,139.01 J7.T
N$67
  Top 0.254: IC10.3 201.93,44.45 R24.1
N$68
  Top 0.254: R10.1 66.67,139.06 X2.4
N$69
  Top 0.254: IC10.4 201.93,41.91 R22.1
N$70
  Top 0.254: IC10.5 201.93,39.37 R20.1
N$72
  Top 0.254: X1.4 43.81,136.53 43.81,127 R8.1
N$73
  Top 0.254: D3.A 49.53,127.63 OK1.3 53.34,127.63 54.61,128.91 54.61,137.16 X1.5
N$75
  Top 0.254: R34.2 214.63,46.99 214.63,27.94 208.28,21.59 LED5.A
N$76
  Top 0.254: R7.2 209.55,139.06 209.81,139.33 J8.T
N$78
  Top 0.254: R32.2 214,45.09 214,28.57 207.01,21.59 207.01,16.51 LED3.A
N$79
  Top 0.61: U$22.15 219.38,87 221.62,87 222.88,88.27 222.88,94.61 214.63,102.87 R15.2
N$80
  Top 0.254: LED1.A 209.55,11.43 209.55,21.59 215.27,27.3 215.27,48.26 212.72,50.8 211.46,50.8 210.82,50.16 210.82,45.72 R26.2
N$81
  Top 0.305: IC1.1 91.44,130.18 R1.1
N$82
  Top 0.254: IC8.13 10.16,22.86 9.02,21.72 Q1.1 4.95,21.72 3.81,22.86 C24.2
N$83
  Top 0.254: C22.2 3.81,25.4 4.95,26.54 Q1.2 9.02,26.54 10.16,25.4 IC8.12
N$84
  Top 0.254: LED6.A 203.2,29.85 211.46,38.1 212.72,38.1 213.36,38.73 213.36,40.64 R24.2
N$85
  Top 0.254: LED4.A 201.93,16.51 201.93,29.85 211.46,39.37 R22.2
N$86
  Top 0.254: LED2.A 204.47,11.43 204.47,29.85 211.46,36.83 R20.2
N$87
  Top 0.254: IC11.9 120.65,31.75 124.46,35.56 124.46,36.83 125.73,38.1 128.27,38.1 130.81,35.56 142.88,35.56 145.41,33.02 194.94,33.02 196.85,34.92 196.85,42.54 194.94,44.45 IC10.14
N$88  (via drill 0.6)
  Top 0.254: IC9.12 43.81,20.32 45.09,19.05 47.62,19.05 50.17,16.51 v53.97,16.51 | RN2.8 53.97,30.48 55.88,28.57 55.88,23.5 60.96,18.42 170.81,18.42 v171.45,17.78 171.5,17.78
  Bottom 0.254: v53.97,16.51 54.61,17.14 54.61,28.57 52.7,30.48 RN2.8 | S2.4 171.45,21.44 v171.45,17.78 171.45,9.04 S2.3
N$89
  Top 0.254: IC10.2 201.93,46.99 R26.1
N$90  (via drill 0.6)
  Top 0.254: IC9.13 43.81,22.86 45.09,21.59 47.62,21.59 50.17,19.05 v53.34,19.05 | RN2.7 53.97,27.94 55.25,26.67 55.25,22.86 60.33,17.78 153.03,17.78 v153.67,17.14
  Bottom 0.254: v53.34,19.05 53.97,19.69 53.97,26.67 52.7,27.94 RN2.7 | S3.4 153.67,21.44 v153.67,17.14 153.72,17.09 S3.3
N$95  (via drill 0.6)
  Top 0.254: IC9.6 47.62,17.78 50.17,15.24 RN2.2 55.25,15.24 55.88,14.6 64.14,14.6 64.45,14.29 v64.77,14.29
  Bottom 0.254: S8.4 64.77,21.44 v64.77,14.29 64.77,9.04 S8.3
N$96
  Top 0.254: LED7.A 205.74,29.85 210.19,34.29 R18.2
N$98
  Top 0.254: IC10.6 201.93,36.83 R18.1
POTS0  (via drill 0.6)
  Top 0.254: IC8.40 31.75,53.34 34.93,56.52 34.93,94.61 37.47,97.16 72.39,97.16 v73.03,97.79
  Bottom 0.254: v73.03,97.79 R40.P$2
POTS1  (via drill 0.6)
  Top 0.254: IC8.39 30.48,50.8 35.56,55.88 35.56,93.98 38.1,96.52 109.22,96.52 v110.49,97.79
  Bottom 0.254: v110.49,97.79 R39.P$2
POTS2
  Top 0.254: IC8.38 29.21,48.26 36.2,55.24 36.2,93.34 38.73,95.88 142.88,95.88 147.96,100.97 R38.P$2
POTS3
  Top 0.254: IC8.37 27.94,45.72 36.83,54.61 36.83,92.71 39.37,95.25 179.71,95.25 185.42,100.97 R37.P$2
POTS4
  Top 0.254: IC8.36 31.75,43.18 38.73,50.16 111.12,50.16 116.21,55.24 139.7,55.24 144.15,50.8 179.57,50.8 185.42,44.95 R28.P$2
POTS5
  Top 0.254: IC8.35 30.48,40.64 39.37,49.53 111.76,49.53 116.84,54.61 139.06,54.61 147.96,45.72 R29.P$2
POTS6
  Top 0.254: IC8.34 29.21,38.1 40.01,48.89 107.95,48.89 110.49,46.35 R30.P$2
POTS7
  Top 0.254: IC8.33 27.94,35.56 40.64,48.26 70.48,48.26 73.03,45.72 R31.P$2
RESET
  Top 0.254: C17.1 R16.1 7.62,43.81 U1.5
  Bottom 0.254: IC8.9 10.16,33.02 5.71,37.46 5.71,41.91 U1.5
RS0
  Top 0.254: 130.76,139.65 J3.TN 130.76,139.75
  Top 0.305: RN1.2 106.68,125.73 116.84,135.89 116.84,139.7 118.75,141.6 128.91,141.6 130.76,139.75 | 130.76,139.65 130.81,139.65
RS1
  Top 0.254: 148.85,139.33 J4.TN
  Top 0.305: RN1.3 109.22,125.73 116.21,132.72 142.24,132.72 148.85,139.33
RS2
  Top 0.254: RN1.4 111.76,124.46 118.75,131.44
  Top 0.305: 118.75,131.44 158.75,131.44 166.95,139.65 J5.TN
RS3
  Top 0.254: RN1.5 114.3,124.46 120.02,130.18
  Top 0.305: 120.02,130.18 176.53,130.18 185.05,138.69 J6.TN
RS4
  Top 0.254: RN1.6 116.84,125.09 120.65,128.91
  Top 0.305: 120.65,128.91 192.41,128.91 203.15,139.65 J7.TN
RS5
  Top 0.254: RN1.7 119.38,126.37 120.65,127.63
  Top 0.305: 120.65,127.63 209.55,127.63 221.24,139.33 J8.TN
SCK  (via drill 0.6)
  Top 0.254: IC8.8 13.33,35.56 17.78,40 17.78,67.94 v18.41,68.58 18.41,69.22 33.66,84.45 v33.66,93.98 33.66,94.61 38.1,99.06 v85.09,99.06 139.06,99.06 144.15,104.14 147.96,104.14 | 147.96,104.14 153.67,104.14 154.94,102.87 177.8,102.87 179.07,104.14 204.47,104.14 214.63,114.3 JP6.5 | 147.96,104.14 v147.96,104.77 | v85.09,107.31 85.09,109.86 80.01,114.94 JP2.5
  Bottom 0.254: IC8.8 10.16,35.56 8.89,36.83 8.89,38.73 U1.3 | JP4.5 147.32,107.31 147.96,106.68 v147.96,104.77 | v85.09,99.06 v85.09,107.31 | v33.66,93.98 7.62,93.98 6.35,95.25 IC3.5 | v18.41,68.58 10.16,68.58 7.62,66.04 JP7.1
SCK_3V3  (via drill 0.6)
  Top 0.254: v22.86,120.02 17.14,120.02 8.89,111.76 8.89,109.22 7.62,107.95 7.62,105.41 6.35,104.14 3.81,104.14 3.17,103.5 3.17,98.42 3.81,97.79 IC3.4
  Bottom 0.254: v22.86,120.02 22.86,124.75 U$26.5
SS
  Top 0.254: IC8.5 12.7,43.18 14.6,45.09 14.6,55.88 13.33,57.15 13.33,80.01 16.51,83.19 16.51,96.52 17.78,97.79 IC4.4
SS0
  Top 0.254: IC4.15 27.94,102.87 32.38,107.31 63.5,107.31 69.85,113.66 JP2.1
SS1
  Top 0.254: IC4.14 27.94,100.33 28.58,100.97 28.58,102.23 33.02,106.68 69.85,106.68 72.39,109.22 JP2.2
SS2
  Top 0.254: IC4.13 27.94,97.79 29.21,99.06 29.21,101.6 33.66,106.05 134.62,106.05 137.16,108.58 JP4.1
SS3
  Top 0.254: IC4.12 27.94,95.25 29.84,97.16 29.84,100.97 34.29,105.41 135.25,105.41 139.7,109.86 JP4.2
SS4
  Top 0.254: IC4.11 27.94,92.71 30.48,95.25 30.48,100.33 34.93,104.77 135.89,104.77 142.88,111.76 153.03,111.76 158.75,106.05 174.62,106.05 175.9,107.31 202.56,107.31 204.47,109.22 JP6.1
SS5
  Top 0.254: IC4.10 31.12,94.61 31.12,99.69 35.56,104.14 136.53,104.14 139.7,107.31 144.78,107.31 145.41,107.95 150.5,107.95 151.77,106.68 156.21,106.68 157.48,105.41 175.26,105.41 176.53,106.68 203.2,106.68 207.01,110.49 JP6.2
SS6  (via drill 0.6)
  Top 0.254: IC4.9 22.86,87.63 14.6,79.38 v14.6,72.39
  Bottom 0.254: JP7.4 7.62,73.66 8.89,72.39 v14.6,72.39
SS7
  Bottom 0.254: IC3.7 6.35,90.17 7.62,91.44 14.6,91.44 15.87,90.17 IC4.7
SS7_3V3  (via drill 0.6)
  Top 0.254: v33.02,121.28 29.84,118.11 17.78,118.11 10.16,110.49 10.16,107.95 8.89,106.68 8.89,95.25 6.35,92.71 IC3.6
  Bottom 0.254: v33.02,121.28 32.94,121.37 U$26.1
SS_ADDR0
  Top 0.254: IC8.1 11.43,81.91 14.6,85.09 14.6,102.23 17.78,105.41 IC4.1
SS_ADDR1
  Top 0.254: IC4.2 17.78,102.87 15.24,100.33 15.24,84.45 12.06,81.28 12.06,55.88 13.33,54.61 13.33,51.43 12.7,50.8 IC8.2
SS_ADDR2
  Top 0.254: IC8.3 12.7,48.26 13.97,49.53 13.97,55.24 12.7,56.52 12.7,80.64 15.87,83.82 15.87,98.42 17.78,100.33 IC4.3
VCC  (via drill 0.6)
  Top 0.61: JP1.3 57.15,114.3 56.52,113.66 51.44,113.66 50.17,114.94 50.17,116.2 53.66,119.7 69.53,119.7 78.11,128.27 v78.11,132.08 | 102.23,132.08 IC1.8 | v102.23,141.6 102.23,132.08 | 102.23,132.08 C3.1 | JP5.3 191.77,116.84 196.85,121.92 229.24,121.92 | JP3.3 124.46,116.84 129.54,121.92 149.22,121.92 v151.13,123.83 | v151.13,133.35 v151.13,143.51
  Top 1.016: v217.17,147.32 v151.13,147.32 v102.23,147.32 89.53,147.32 v78.11,135.89 | v222.25,142.24 229.24,135.25 229.24,121.92 229.24,65.41 231.14,63.5 C16.+ IC6.OUT 237.49,62.23 D6.A D7.C
  Bottom 0.61: v78.11,135.89 v78.11,132.08 | v102.23,147.32 v102.23,141.6 | v151.13,123.83 v151.13,133.35 | v151.13,143.51 v151.13,147.32
  Bottom 1.016: v217.17,147.32 v222.25,142.24
VEE  (via drill 0.6)
  Top 0.61: JP1.5 62.23,114.3 60.33,112.39 50.8,112.39 48.9,114.3 48.9,116.84 53.02,120.97 69.22,120.97 76.84,128.59 76.84,132.72 89.53,145.41 90.81,145.41 | C7.2 IC1.4 93.98,122.55 95.25,123.83 v95.25,140.97 | JP3.5 129.54,116.84 132.72,120.02 149.86,120.02 v153.03,123.19 | JP5.5 196.85,116.84 200.66,120.65 v227.33,120.65 | 153.03,145.41 v153.03,132.72
  Top 1.016: 90.81,145.41 v95.25,145.41 153.03,145.41 221.62,145.41 231.14,135.89 v231.14,120.65 231.14,81.91 C14.- IC5.OUT 238.76,81.28 242.57,77.47 D4.C D5.A
  Bottom 0.61: v95.25,140.97 v95.25,145.41 | v231.14,120.65 v227.33,120.65 | v153.03,132.72 v153.03,123.19

### Text on the board
Top: Ambika motherboard | cc-by-sa, Émilie Gillet. v0.9
tNames: In | Out | 4.7k to 10K | Port 1-2 | Port 3-4 | Port 5-6 | Port 7 | +5V | GND | SS | MOSI | MISO | SCK | 1
bNames: 1 | 2 | 3 | 4 | 5 | 6 | In | Out | 9VAC 1A | Contrast
tStop: Ambika motherboard | cc-by-sa, Olivier Gillet. v0.9